# EAGLE schematic pcDuino3c_MB (EAGLE 7.2.0)

## Sheet 1 of 8: PWR
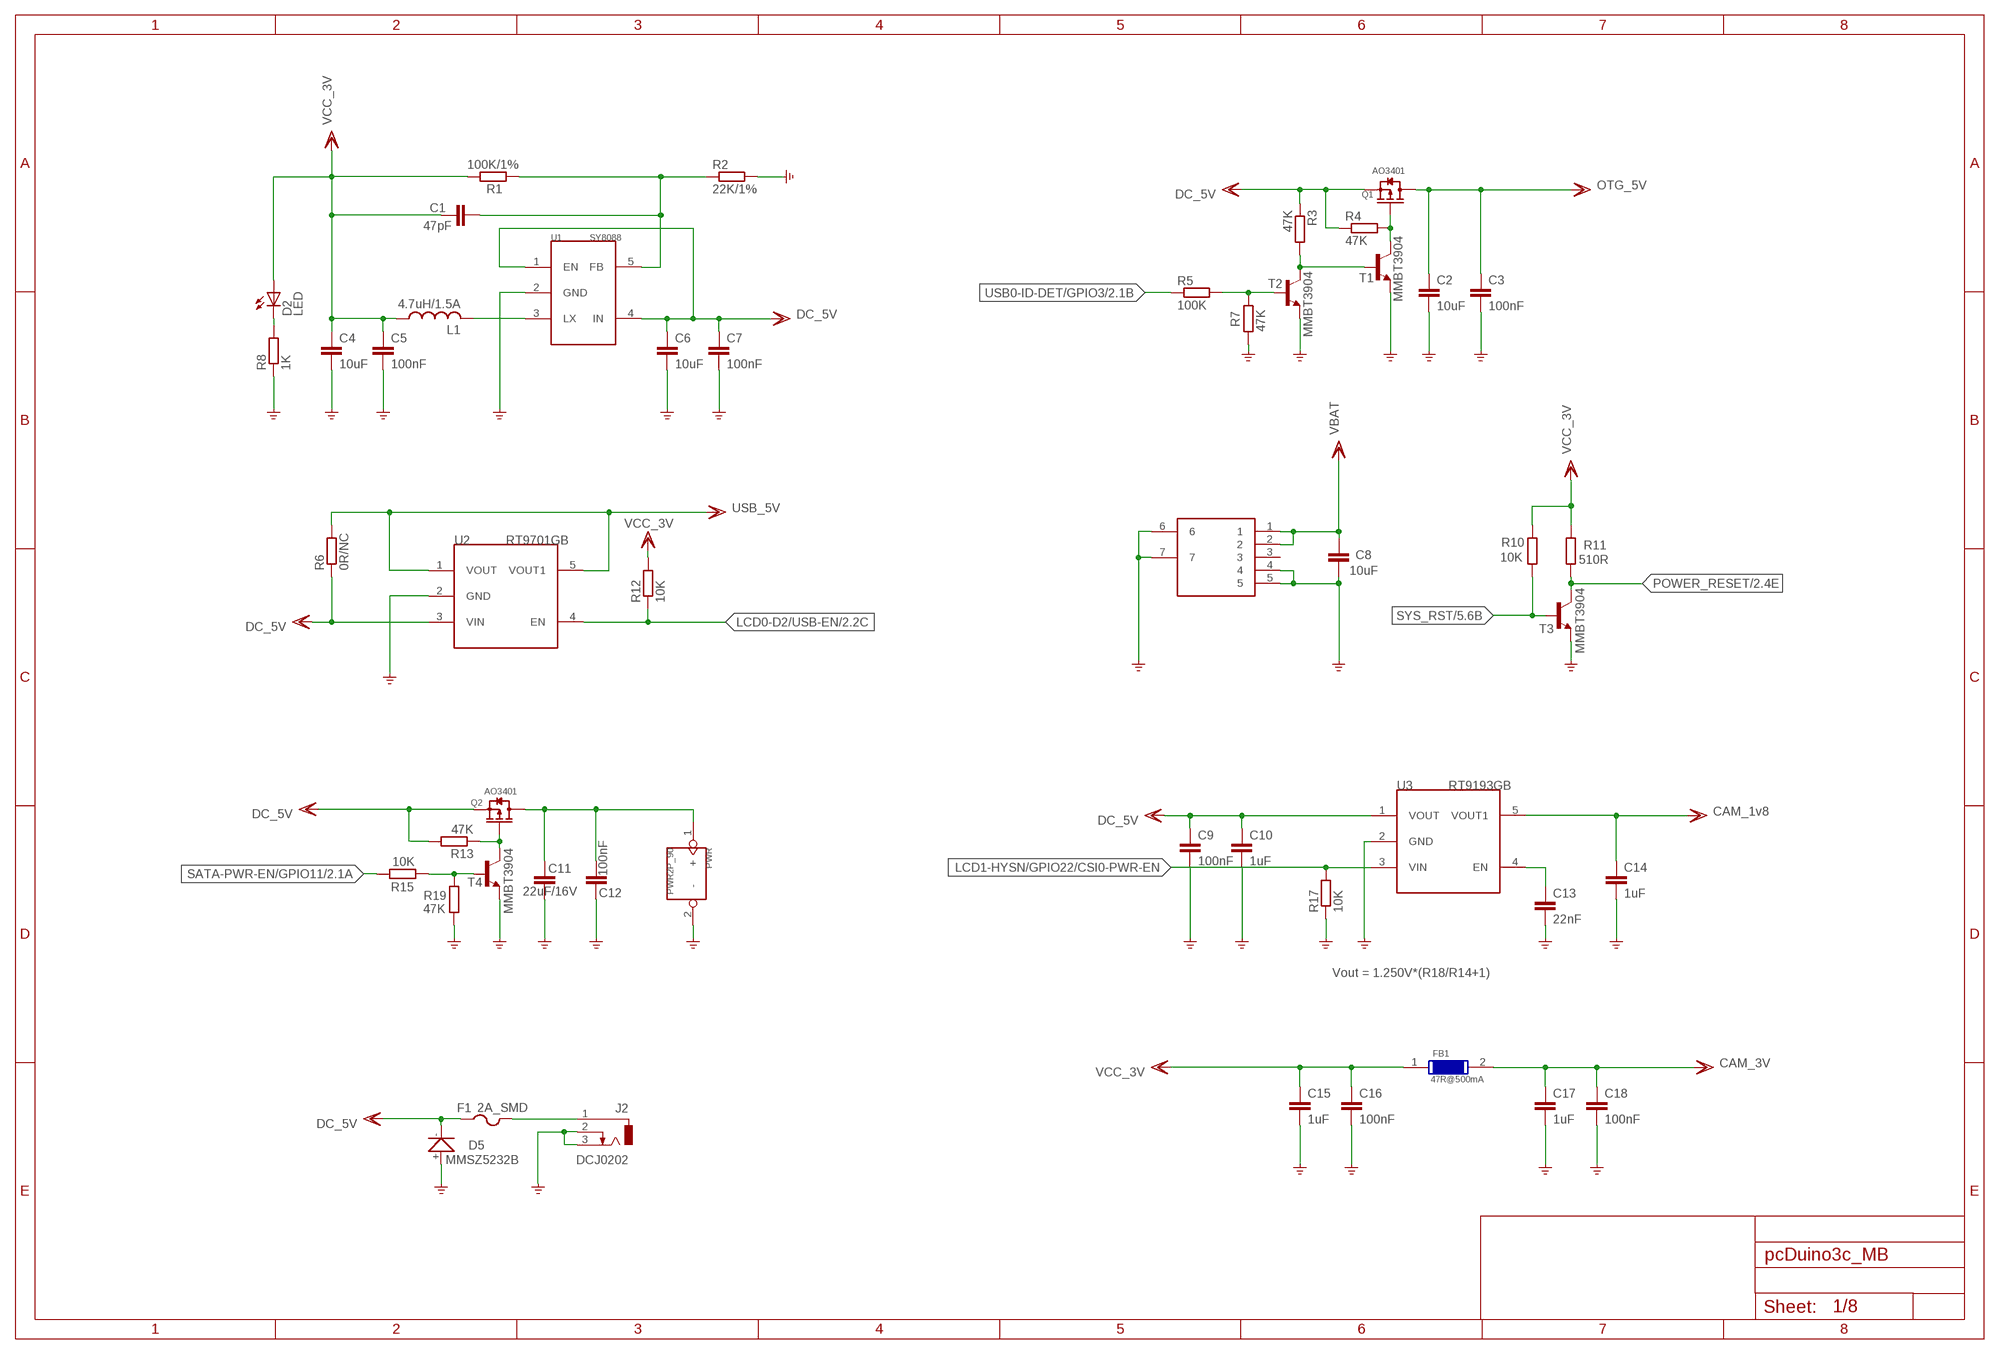
[diagram p0: schematic, sheet 1]

### Parts
C1  47pF  C-EUC0402K  [C0402K]
C2  10uF  C-EUC0805  [C0805]
C3  100nF  C-EUC0402K  [C0402K]
C4  10uF  C-EUC0805  [C0805]
C5  100nF  C-EUC0402K  [C0402K]
C6  10uF  C-EUC0805  [C0805]
C7  100nF  C-EUC0402K  [C0402K]
C8  10uF  C-EUC0805  [C0805]
C9  100nF  C-EUC0805  [C0805]
C10  1uF  C-EUC0402K  [C0402K]
C11  22uF/16V  C-EUC0805  [C0805]
C12  100nF  C-EUC0402K  [C0402K]
C13  22nF  C-EUC0402K  [C0402K]
C14  1uF  C-EUC0402K  [C0402K]
C15  1uF  C-EUC0805  [C0805]
C16  100nF  C-EUC0402K  [C0402K]
C17  1uF  C-EUC0805  [C0805]
C18  100nF  C-EUC0402K  [C0402K]
D2  LED  [CHIP-LED-0805]
D5  MMSZ5232B  DIODE-SMDSOD123  [SOD123]
F1  2A_SMD  PTCFUSE-1206  [R1206]
FB1  47R@500mA  LI0603EXXXR-10  [R0603]
J1  CON-BAT  [CON-BAT-5P-1MM]
J2  DCJ0202  [DCJ0202]
L1  4.7uH/1.5A  INDICATORCD32  [L_CD32]
PWR  PWR2P_90  [PWR2P_2.54]
Q1  AO3401  P-MOSSOT23  [SOT23]
Q2  AO3401  P-MOSSOT23  [SOT23]
R1  100K/1%  R-EU_R0402  [R0402]
R2  22K/1%  R-EU_R0402  [R0402]
R3  47K  R-EU_R0402  [R0402]
R4  47K  R-EU_R0402  [R0402]
R5  100K  R-EU_R0402  [R0402]
R6  0R/NC  R-EU_R0402  [R0402]
R7  47K  R-EU_R0402  [R0402]
R8  1K  R-EU_R0402  [R0402]
R10  10K  R-EU_R0402  [R0402]
R11  510R  R-EU_R0402  [R0402]
R12  10K  R-EU_R0402  [R0402]
R13  47K  R-EU_R0402  [R0402]
R15  10K  R-EU_R0402  [R0402]
R17  10K  R-EU_R0402  [R0402]
R19  47K  R-EU_R0402  [R0402]
T1  MMBT3904  BC808-NPN-SOT23-BEC  [SOT23-BEC]
T2  MMBT3904  BC808-NPN-SOT23-BEC  [SOT23-BEC]
T3  MMBT3904  BC808-NPN-SOT23-BEC  [SOT23-BEC]
T4  MMBT3904  BC808-NPN-SOT23-BEC  [SOT23-BEC]
U1  SY8088  [SOT23-5]
U2  RT9701GB  [SOT23-5]
U3  RT9193GB  RT9701GB  [SOT23-5]

### Nets
CAM_1V8: C14.1 U3.5(VOUT1) ; supply symbol labelled CAM_1v8 ; also sheet 5
CAM_3V: C17.1 C18.1 FB1.2 ; also sheet 5
DC_5V: C6.1 C7.1 C9.1 C10.1 D5.- F1.1 Q1.2(S) Q2.2(S) R3.1 R4.1 R6.1 R13.2 U1.1(EN) U1.4(IN) U2.3(VIN) U3.1(VOUT) ; also sheet 2,5,6,7
GND: C2.2 C3.2 C4.2 C5.2 C6.2 C7.2 C8.2 C9.2 C10.2 C11.2 C12.2 C13.2 C14.2 C15.2 C16.2 C17.2 C18.2 D5.+ J1.4 J1.5 J1.6 J1.7 J2.2 J2.3 PWR.2(-) R2.2 R7.1 R8.1 R17.1 R19.1 T1.E T2.E T3.E T4.E U1.2(GND) U2.2(GND) U3.2(GND) ; also sheet 2,3,4,5,6,7,8
LCD0-D2/USB-EN: R12.1 U2.4(EN) ; also sheet 2
LCD1-HYSN/GPIO22/CSI0-PWR-EN: R17.2 U3.3(VIN)
N$2: C13.1 U3.4(EN)
N$24: L1.2 U1.3(LX)
N$25: C1.2 R1.1 R2.1 U1.5(FB)
N$26: D2.C R8.2
N$27: Q1.1(G) R4.2 T1.C
N$28: R3.2 T1.B T2.C
N$29: R5.2 R7.2 T2.B
N$31: C11.1 C12.1 PWR.1(+) Q2.3(D)
N$32: F1.2 J2.1
N$75: Q2.1(G) R13.1 T4.C
N$76: R15.1 R19.2 T4.B
OTG_5V: C2.1 C3.1 Q1.3(D) ; also sheet 4
POWER_RESET: R11.1 T3.C ; also sheet 2
SATA-PWR-EN/GPIO11: R15.2 ; also sheet 2
SYS_RST: R10.1 T3.B ; also sheet 5,7
USB0-ID-DET/GPIO3: R5.1 ; also sheet 2,4
USB_5V: R6.2 U2.1(VOUT) U2.5(VOUT1) ; also sheet 4
VBAT: C8.1 J1.1 J1.2 ; also sheet 2
VCC_3V: C1.1 C4.1 C5.1 C15.1 C16.1 D2.A FB1.1 L1.1 R1.2 R10.2 R11.2 R12.2 ; also sheet 3,4,5,6,7,8
Unconnected: J1.3

### Notes on the sheet
- Vout = 1.250V*(R18/R14+1)

## Sheet 2 of 8: A20 Core
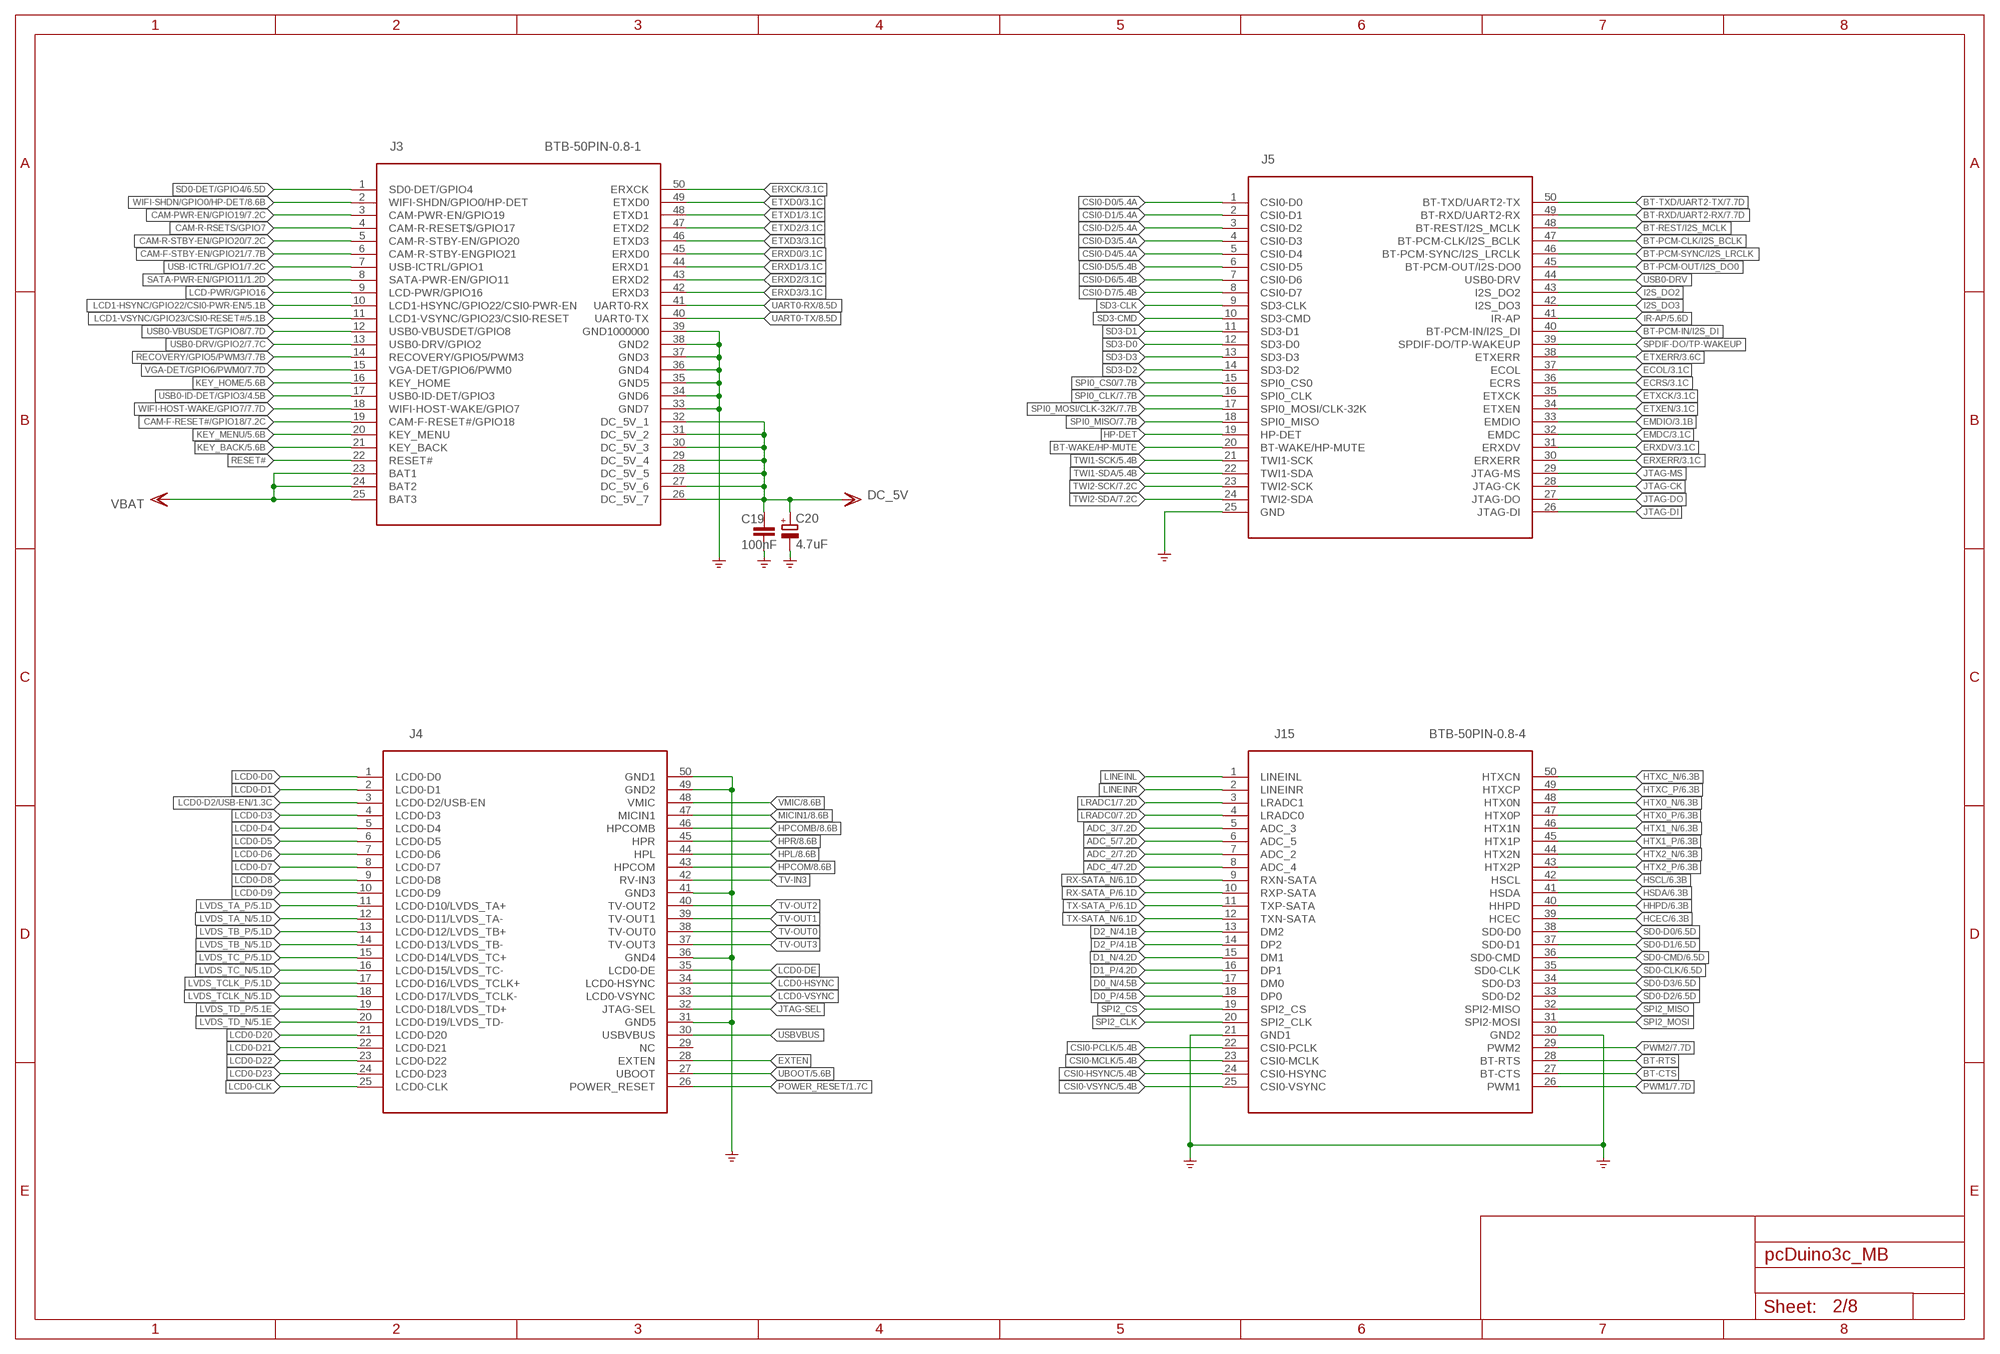
[diagram p1: schematic, sheet 2]

### Parts
C19  100nF  C-EUC0402K  [C0402K]
C20  4.7uF  CPOL-EUCT7343  [CT7343]
J3  BTB-50PIN-0.8-1  [BTB-50PIN-0.8]
J4  BTB-50PIN-0.8-3  [BTB-50PIN-0.8]
J5  BTB-50PIN-0.8-2  [BTB-50PIN-0.8]
J15  BTB-50PIN-0.8-4  [BTB-50PIN-0.8]

### Nets
ADC_2: J15.7(ADC_2) ; also sheet 7
ADC_3: J15.5(ADC_3) ; also sheet 7
ADC_4: J15.8(ADC_4) ; also sheet 7
ADC_5: J15.6(ADC_5) ; also sheet 7
BT-CTS: J15.27(BT-CTS)
BT-PCM-CLK/I2S_BCLK: J5.47(BT-PCM-CLK/I2S_BCLK)
BT-PCM-IN/I2S_DI: J5.40(BT-PCM-IN/I2S_DI)
BT-PCM-OUT/I2S_DO0: J5.45(BT-PCM-OUT/I2S-DO0)
BT-PCM-SYNC/I2S_LRCLK: J5.46(BT-PCM-SYNC/I2S_LRCLK)
BT-REST/I2S_MCLK: J5.48(BT-REST/I2S_MCLK)
BT-RTS: J15.28(BT-RTS)
BT-RXD/UART2-RX: J5.49(BT-RXD/UART2-RX) ; also sheet 7
BT-TXD/UART2-TX: J5.50(BT-TXD/UART2-TX) ; also sheet 7
BT-WAKE/HP-MUTE: J5.20(BT-WAKE/HP-MUTE)
CAM-F-RESET#/GPIO18: J3.19(CAM-F-RESET#/GPIO18) ; also sheet 7
CAM-F-STBY-EN/GPIO21: J3.6(CAM-R-STBY-ENGPIO21) ; also sheet 7
CAM-PWR-EN/GPIO19: J3.3(CAM-PWR-EN/GPIO19) ; also sheet 7
CAM-R-RSETS/GPIO7: J3.4(CAM-R-RESET$/GPIO17)
CAM-R-STBY-EN/GPIO20: J3.5(CAM-R-STBY-EN/GPIO20) ; also sheet 7
CSI0-D0: J5.1(CSI0-D0) ; also sheet 5
CSI0-D1: J5.2(CSI0-D1) ; also sheet 5
CSI0-D2: J5.3(CSI0-D2) ; also sheet 5
CSI0-D3: J5.4(CSI0-D3) ; also sheet 5
CSI0-D4: J5.5(CSI0-D4) ; also sheet 5
CSI0-D5: J5.6(CSI0-D5) ; also sheet 5
CSI0-D6: J5.7(CSI0-D6) ; also sheet 5
CSI0-D7: J5.8(CSI0-D7) ; also sheet 5
CSI0-HSYNC: J15.24(CSI0-HSYNC) ; also sheet 5
CSI0-MCLK: J15.23(CSI0-MCLK) ; also sheet 5
CSI0-PCLK: J15.22(CSI0-PCLK) ; also sheet 5
CSI0-VSYNC: J15.25(CSI0-VSYNC) ; also sheet 5
D0_N: J15.17(DM0) ; also sheet 4
D0_P: J15.18(DP0) ; also sheet 4
D1_N: J15.15(DM1) ; also sheet 4
D1_P: J15.16(DP1) ; also sheet 4
D2_N: J15.13(DM2) ; also sheet 4
D2_P: J15.14(DP2) ; also sheet 4
DC_5V: C19.1 C20.+ J3.26(DC_5V_7) J3.27(DC_5V_6) J3.28(DC_5V_5) J3.29(DC_5V_4) J3.30(DC_5V_3) J3.31(DC_5V_2) J3.32(DC_5V_1) ; also sheet 1,5,6,7
ECOL: J5.37(ECOL) ; also sheet 3
ECRS: J5.36(ECRS) ; also sheet 3
EMDC: J5.32(EMDC) ; also sheet 3
EMDIO: J5.33(EMDIO) ; also sheet 3
ERXCK: J3.50(ERXCK) ; also sheet 3
ERXD0: J3.45(ERXD0) ; also sheet 3
ERXD1: J3.44(ERXD1) ; also sheet 3
ERXD2: J3.43(ERXD2) ; also sheet 3
ERXD3: J3.42(ERXD3) ; also sheet 3
ERXDV: J5.31(ERXDV) ; also sheet 3
ERXERR: J5.30(ERXERR) ; also sheet 3
ETXCK: J5.35(ETXCK) ; also sheet 3
ETXD0: J3.49(ETXD0) ; also sheet 3
ETXD1: J3.48(ETXD1) ; also sheet 3
ETXD2: J3.47(ETXD2) ; also sheet 3
ETXD3: J3.46(ETXD3) ; also sheet 3
ETXEN: J5.34(ETXEN) ; also sheet 3
ETXERR: J5.38(ETXERR) ; also sheet 3
EXTEN: J4.28(EXTEN)
GND: C19.2 C20.- J3.33(GND7) J3.34(GND6) J3.35(GND5) J3.36(GND4) J3.37(GND3) J3.38(GND2) J3.39(GND1000000) J4.31(GND5) J4.36(GND4) J4.41(GND3) J4.49(GND2) J4.50(GND1) J5.25(GND) J15.21(GND1) J15.30(GND2) ; also sheet 1,3,4,5,6,7,8
HCEC: J15.39(HCEC) ; also sheet 6
HHPD: J15.40(HHPD) ; also sheet 6
HP-DET: J5.19(HP-DET)
HPCOM: J4.43(HPCOM) ; also sheet 8
HPCOMB: J4.46(HPCOMB) ; also sheet 8
HPL: J4.44(HPL) ; also sheet 8
HPR: J4.45(HPR) ; also sheet 8
HSCL: J15.42(HSCL) ; also sheet 6
HSDA: J15.41(HSDA) ; also sheet 6
HTX0_N: J15.48(HTX0N) ; also sheet 6
HTX0_P: J15.47(HTX0P) ; also sheet 6
HTX1_N: J15.46(HTX1N) ; also sheet 6
HTX1_P: J15.45(HTX1P) ; also sheet 6
HTX2_N: J15.44(HTX2N) ; also sheet 6
HTX2_P: J15.43(HTX2P) ; also sheet 6
HTXC_N: J15.50(HTXCN) ; also sheet 6
HTXC_P: J15.49(HTXCP) ; also sheet 6
I2S_DO2: J5.43(I2S_DO2)
I2S_DO3: J5.42(I2S_DO3)
IR-AP: J5.41(IR-AP) ; also sheet 5
JTAG-CK: J5.28(JTAG-CK)
JTAG-DI: J5.26(JTAG-DI)
JTAG-DO: J5.27(JTAG-DO)
JTAG-MS: J5.29(JTAG-MS)
JTAG-SEL: J4.32(JTAG-SEL)
KEY_BACK: J3.21(KEY_BACK) ; also sheet 5
KEY_HOME: J3.16(KEY_HOME) ; also sheet 5
KEY_MENU: J3.20(KEY_MENU) ; also sheet 5
LCD0-CLK: J4.25(LCD0-CLK)
LCD0-D0: J4.1(LCD0-D0)
LCD0-D1: J4.2(LCD0-D1)
LCD0-D2/USB-EN: J4.3(LCD0-D2/USB-EN) ; also sheet 1
LCD0-D3: J4.4(LCD0-D3)
LCD0-D4: J4.5(LCD0-D4)
LCD0-D5: J4.6(LCD0-D5)
LCD0-D6: J4.7(LCD0-D6)
LCD0-D7: J4.8(LCD0-D7)
LCD0-D8: J4.9(LCD0-D8)
LCD0-D9: J4.10(LCD0-D9)
LCD0-D20: J4.21(LCD0-D20)
LCD0-D21: J4.22(LCD0-D21)
LCD0-D22: J4.23(LCD0-D22)
LCD0-D23: J4.24(LCD0-D23)
LCD0-DE: J4.35(LCD0-DE)
LCD0-HSYNC: J4.34(LCD0-HSYNC)
LCD0-VSYNC: J4.33(LCD0-VSYNC)
LCD1-HSYNC/GPIO22/CSI0-PWR-EN: J3.10(LCD1-HSYNC/GPIO22/CSI0-PWR-EN) ; also sheet 5
LCD1-VSYNC/GPIO23/CSI0-RESET#: J3.11(LCD1-VSYNC/GPIO23/CSI0-RESET) ; also sheet 5
LCD-PWR/GPIO16: J3.9(LCD-PWR/GPIO16)
LINEINL: J15.1(LINEINL)
LINEINR: J15.2(LINEINR)
LRADC0: J15.4(LRADC0) ; also sheet 7
LRADC1: J15.3(LRADC1) ; also sheet 7
LVDS_TA_N: J4.12(LCD0-D11/LVDS_TA-) ; also sheet 5
LVDS_TA_P: J4.11(LCD0-D10/LVDS_TA+) ; also sheet 5
LVDS_TB_N: J4.14(LCD0-D13/LVDS_TB-) ; also sheet 5
LVDS_TB_P: J4.13(LCD0-D12/LVDS_TB+) ; also sheet 5
LVDS_TC_N: J4.16(LCD0-D15/LVDS_TC-) ; also sheet 5
LVDS_TC_P: J4.15(LCD0-D14/LVDS_TC+) ; also sheet 5
LVDS_TCLK_N: J4.18(LCD0-D17/LVDS_TCLK-) ; also sheet 5
LVDS_TCLK_P: J4.17(LCD0-D16/LVDS_TCLK+) ; also sheet 5
LVDS_TD_N: J4.20(LCD0-D19/LVDS_TD-) ; also sheet 5
LVDS_TD_P: J4.19(LCD0-D18/LVDS_TD+) ; also sheet 5
MICIN1: J4.47(MICIN1) ; also sheet 8
POWER_RESET: J4.26(POWER_RESET) ; also sheet 1
PWM1: J15.26(PWM1) ; also sheet 7
PWM2: J15.29(PWM2) ; also sheet 7
RECOVERY/GPIO5/PWM3: J3.14(RECOVERY/GPIO5/PWM3) ; also sheet 7
RESET#: J3.22(RESET#)
RX-SATA_N: J15.9(RXN-SATA) ; also sheet 6
RX-SATA_P: J15.10(RXP-SATA) ; also sheet 6
SATA-PWR-EN/GPIO11: J3.8(SATA-PWR-EN/GPIO11) ; also sheet 1
SD0-CLK: J15.35(SD0-CLK) ; also sheet 6
SD0-CMD: J15.36(SD0-CMD) ; also sheet 6
SD0-D0: J15.38(SD0-D0) ; also sheet 6
SD0-D1: J15.37(SD0-D1) ; also sheet 6
SD0-D2: J15.33(SD0-D2) ; also sheet 6
SD0-D3: J15.34(SD0-D3) ; also sheet 6
SD0-DET/GPIO4: J3.1(SD0-DET/GPIO4) ; also sheet 6
SD3-CLK: J5.9(SD3-CLK)
SD3-CMD: J5.10(SD3-CMD)
SD3-D0: J5.12(SD3-D0)
SD3-D1: J5.11(SD3-D1)
SD3-D2: J5.14(SD3-D2)
SD3-D3: J5.13(SD3-D3)
SPDIF-DO/TP-WAKEUP: J5.39(SPDIF-DO/TP-WAKEUP)
SPI0_CLK: J5.16(SPI0_CLK) ; also sheet 7
SPI0_CS0: J5.15(SPI0_CS0) ; also sheet 7
SPI0_MISO: J5.18(SPI0_MISO) ; also sheet 7
SPI0_MOSI/CLK-32K: J5.17(SPI0_MOSI/CLK-32K) ; also sheet 7
SPI2_CLK: J15.20(SPI2_CLK)
SPI2_CS: J15.19(SPI2_CS)
SPI2_MISO: J15.32(SPI2-MISO)
SPI2_MOSI: J15.31(SPI2-MOSI)
TV-IN3: J4.42(RV-IN3)
TV-OUT0: J4.38(TV-OUT0)
TV-OUT1: J4.39(TV-OUT1)
TV-OUT2: J4.40(TV-OUT2)
TV-OUT3: J4.37(TV-OUT3)
TWI1-SCK: J5.21(TWI1-SCK) ; also sheet 5
TWI1-SDA: J5.22(TWI1-SDA) ; also sheet 5
TWI2-SCK: J5.23(TWI2-SCK) ; also sheet 7
TWI2-SDA: J5.24(TWI2-SDA) ; also sheet 7
TX-SATA_N: J15.12(TXN-SATA) ; also sheet 6
TX-SATA_P: J15.11(TXP-SATA) ; also sheet 6
UART0-RX: J3.41(UART0-RX) ; also sheet 8
UART0-TX: J3.40(UART0-TX) ; also sheet 8
UBOOT: J4.27(UBOOT) ; also sheet 5
USB0-DRV: J5.44(USB0-DRV)
USB0-DRV/GPIO2: J3.13(USB0-DRV/GPIO2) ; also sheet 7
USB0-ID-DET/GPIO3: J3.17(USB0-ID-DET/GPIO3) ; also sheet 1,4
USB0-VBUSDET/GPIO8: J3.12(USB0-VBUSDET/GPIO8) ; also sheet 7
USB-ICTRL/GPIO1: J3.7(USB-ICTRL/GPIO1) ; also sheet 7
USBVBUS: J4.30(USBVBUS)
VBAT: J3.23(BAT1) J3.24(BAT2) J3.25(BAT3) ; also sheet 1
VGA-DET/GPIO6/PWM0: J3.15(VGA-DET/GPIO6/PWM0) ; also sheet 7
VMIC: J4.48(VMIC) ; also sheet 8
WIFI-HOST-WAKE/GPIO7: J3.18(WIFI-HOST-WAKE/GPIO7) ; also sheet 7
WIFI-SHDN/GPIO0/HP-DET: J3.2(WIFI-SHDN/GPIO0/HP-DET) ; also sheet 8
Unconnected: J4.29(NC)

## Sheet 3 of 8: EMAC
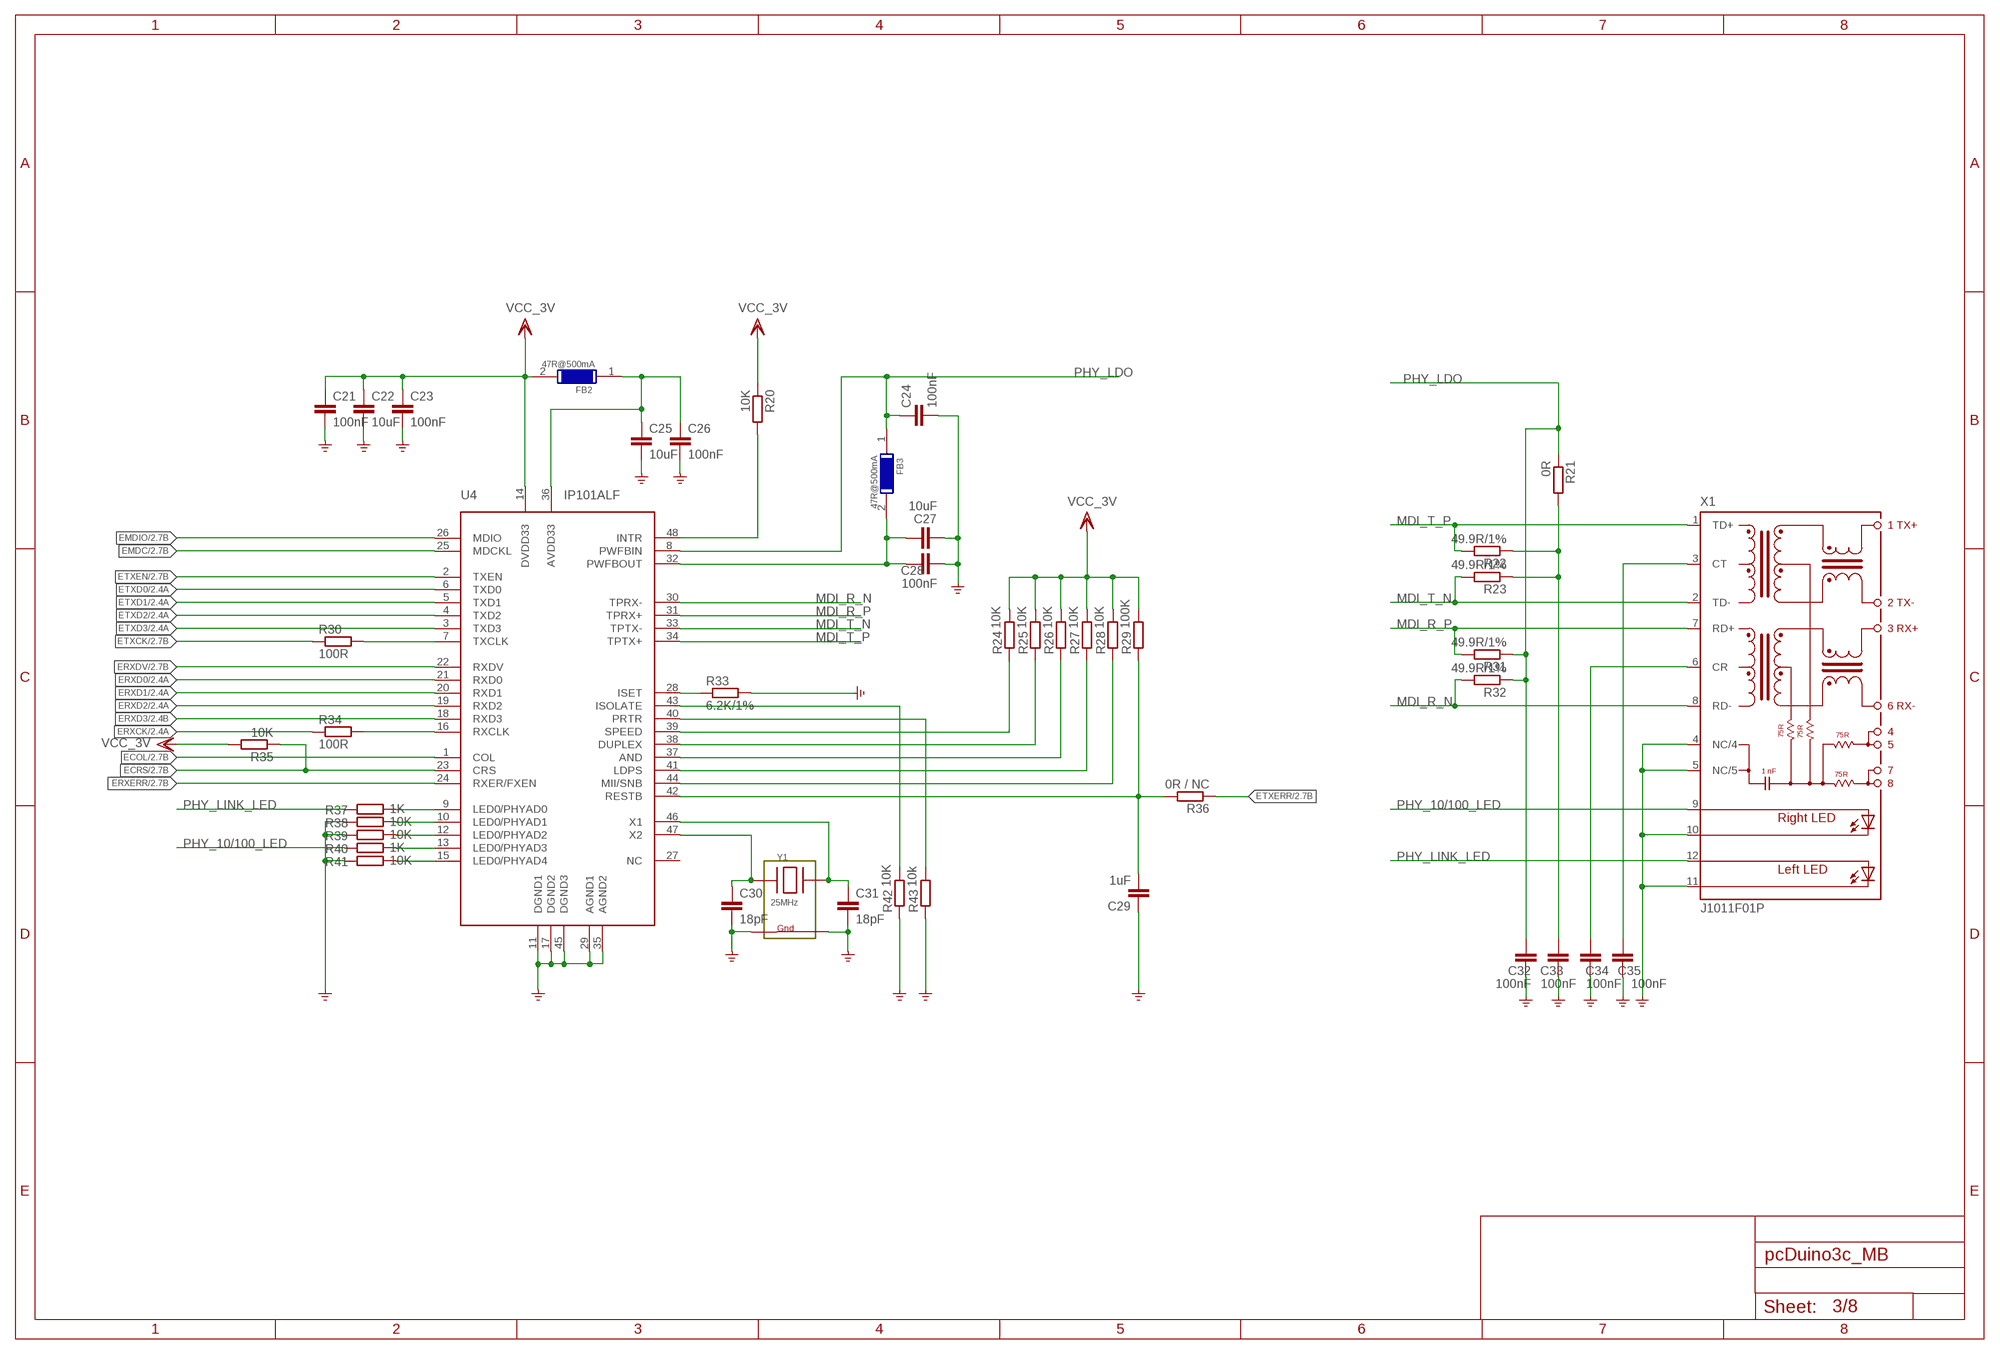
[diagram p2: schematic, sheet 3]

### Parts
C21  100nF  C-EUC0402K  [C0402K]
C22  10uF  C-EUC0805  [C0805]
C23  100nF  C-EUC0402K  [C0402K]
C24  100nF  C-EUC0402K  [C0402K]
C25  10uF  C-EUC0805  [C0805]
C26  100nF  C-EUC0402K  [C0402K]
C27  10uF  C-EUC0805  [C0805]
C28  100nF  C-EUC0402K  [C0402K]
C29  1uF  C-EUC0402K  [C0402K]
C30  18pF  C-EUC0402K  [C0402K]
C31  18pF  C-EUC0402K  [C0402K]
C32  100nF  C-EUC0402K  [C0402K]
C33  100nF  C-EUC0402K  [C0402K]
C34  100nF  C-EUC0402K  [C0402K]
C35  100nF  C-EUC0402K  [C0402K]
FB2  47R@500mA  LI0603EXXXR-10  [R0603]
FB3  47R@500mA  LI0603EXXXR-10  [R0603]
R20  10K  R-EU_R0402  [R0402]
R21  0R  R-EU_R0402  [R0402]
R22  49.9R/1%  R-EU_R0402  [R0402]
R23  49.9R/1%  R-EU_R0402  [R0402]
R24  10K  R-EU_R0402  [R0402]
R25  10K  R-EU_R0402  [R0402]
R26  10K  R-EU_R0402  [R0402]
R27  10K  R-EU_R0402  [R0402]
R28  10K  R-EU_R0402  [R0402]
R29  100K  R-EU_R0402  [R0402]
R30  100R  R-EU_R0402  [R0402]
R31  49.9R/1%  R-EU_R0402  [R0402]
R32  49.9R/1%  R-EU_R0402  [R0402]
R33  6.2K/1%  R-EU_R0402  [R0402]
R34  100R  R-EU_R0402  [R0402]
R35  10K  R-EU_R0402  [R0402]
R36  0R / NC  R-EU_R0402  [R0402]
R37  1K  R-EU_R0402  [R0402]
R38  10K  R-EU_R0402  [R0402]
R39  10K  R-EU_R0402  [R0402]
R40  1K  R-EU_R0402  [R0402]
R41  10K  R-EU_R0402  [R0402]
R42  10K  R-EU_R0402  [R0402]
R43  10k  R-EU_R0402  [R0402]
U4  IP101ALF  [LQFP48-7X7]
X1  J1011F01P  [J1]
Y1  25MHz  XTAL-4-3225  [NX3225]

### Nets
ECOL: U4.1(COL) ; also sheet 2
ECRS: R35.1 U4.23(CRS) ; also sheet 2
EMDC: U4.25(MDCKL) ; also sheet 2
EMDIO: U4.26(MDIO) ; also sheet 2
ERXCK: R34.1 ; also sheet 2
ERXD0: U4.21(RXD0) ; also sheet 2
ERXD1: U4.20(RXD1) ; also sheet 2
ERXD2: U4.19(RXD2) ; also sheet 2
ERXD3: U4.18(RXD3) ; also sheet 2
ERXDV: U4.22(RXDV) ; also sheet 2
ERXERR: U4.24(RXER/FXEN) ; also sheet 2
ETXCK: R30.1 ; also sheet 2
ETXD0: U4.6(TXD0) ; also sheet 2
ETXD1: U4.5(TXD1) ; also sheet 2
ETXD2: U4.4(TXD2) ; also sheet 2
ETXD3: U4.3(TXD3) ; also sheet 2
ETXEN: U4.2(TXEN) ; also sheet 2
ETXERR: R36.1 ; also sheet 2
GND: C21.2 C22.2 C23.2 C24.2 C25.2 C26.2 C27.1 C28.2 C29.1 C30.2 C31.2 C32.1 C33.1 C34.1 C35.1 R33.2 R38.1 R39.1 R41.1 R42.1 R43.1 U4.11(DGND1) U4.17(DGND2) U4.29(AGND1) U4.35(AGND2) U4.45(DGND3) X1.4(NC/4) X1.5(NC/5) X1.10(C-R) X1.11(C-L) Y1.2(G1) Y1.4(G2) ; also sheet 1,2,4,5,6,7,8
MDI_R_N: R32.2 U4.30(TPRX-) X1.8(RD-)
MDI_R_P: R31.2 U4.31(TPRX+) X1.7(RD+)
MDI_T_N: R23.2 U4.33(TPTX-) X1.2(TD-)
MDI_T_P: R22.2 U4.34(TPTX+) X1.1(TD+)
N$33: C25.1 C26.1 FB2.1 U4.36(AVDD33)
N$34: C34.2 X1.6(CR)
N$35: C35.2 X1.3(CT)
N$37: C33.2 R21.2 R22.1 R23.1
N$39: R20.2 U4.48(INTR)
N$41: C27.2 C28.1 FB3.2 U4.32(PWFBOUT)
N$45: R33.1 U4.28(ISET)
N$47: R37.2 U4.9(LED0/PHYAD0)
N$48: R38.2 U4.10(LED0/PHYAD1)
N$49: R39.2 U4.12(LED0/PHYAD2)
N$50: R40.2 U4.13(LED0/PHYAD3)
N$51: R41.2 U4.15(LED0/PHYAD4)
N$52: C30.1 U4.47(X2) Y1.1(X1)
N$92: R34.2 U4.16(RXCLK)
N$93: R30.2 U4.7(TXCLK)
N$96: C31.1 U4.46(X1) Y1.3(X2)
N$98: R27.1 U4.41(LDPS)
N$99: R42.2 U4.43(ISOLATE)
N$100: R43.2 U4.40(PRTR)
N$103: R24.1 U4.39(SPEED)
N$104: R25.1 U4.38(DUPLEX)
N$105: R26.1 U4.37(AND)
N$106: R28.1 U4.44(MII/SNB)
N$107: C29.2 R29.1 R36.2 U4.42(RESTB)
PHY_10/100_LED: R40.1 X1.9(A-R)
PHY_LDO: C24.1 C32.2 FB3.1 R21.1 R31.1 R32.1 U4.8(PWFBIN)
PHY_LINK_LED: R37.1 X1.12(AL)
VCC_3V: C21.1 C22.1 C23.1 FB2.2 R20.1 R24.2 R25.2 R26.2 R27.2 R28.2 R29.2 R35.2 U4.14(DVDD33) ; also sheet 1,4,5,6,7,8
Unconnected: U4.27(NC)

## Sheet 4 of 8: USB
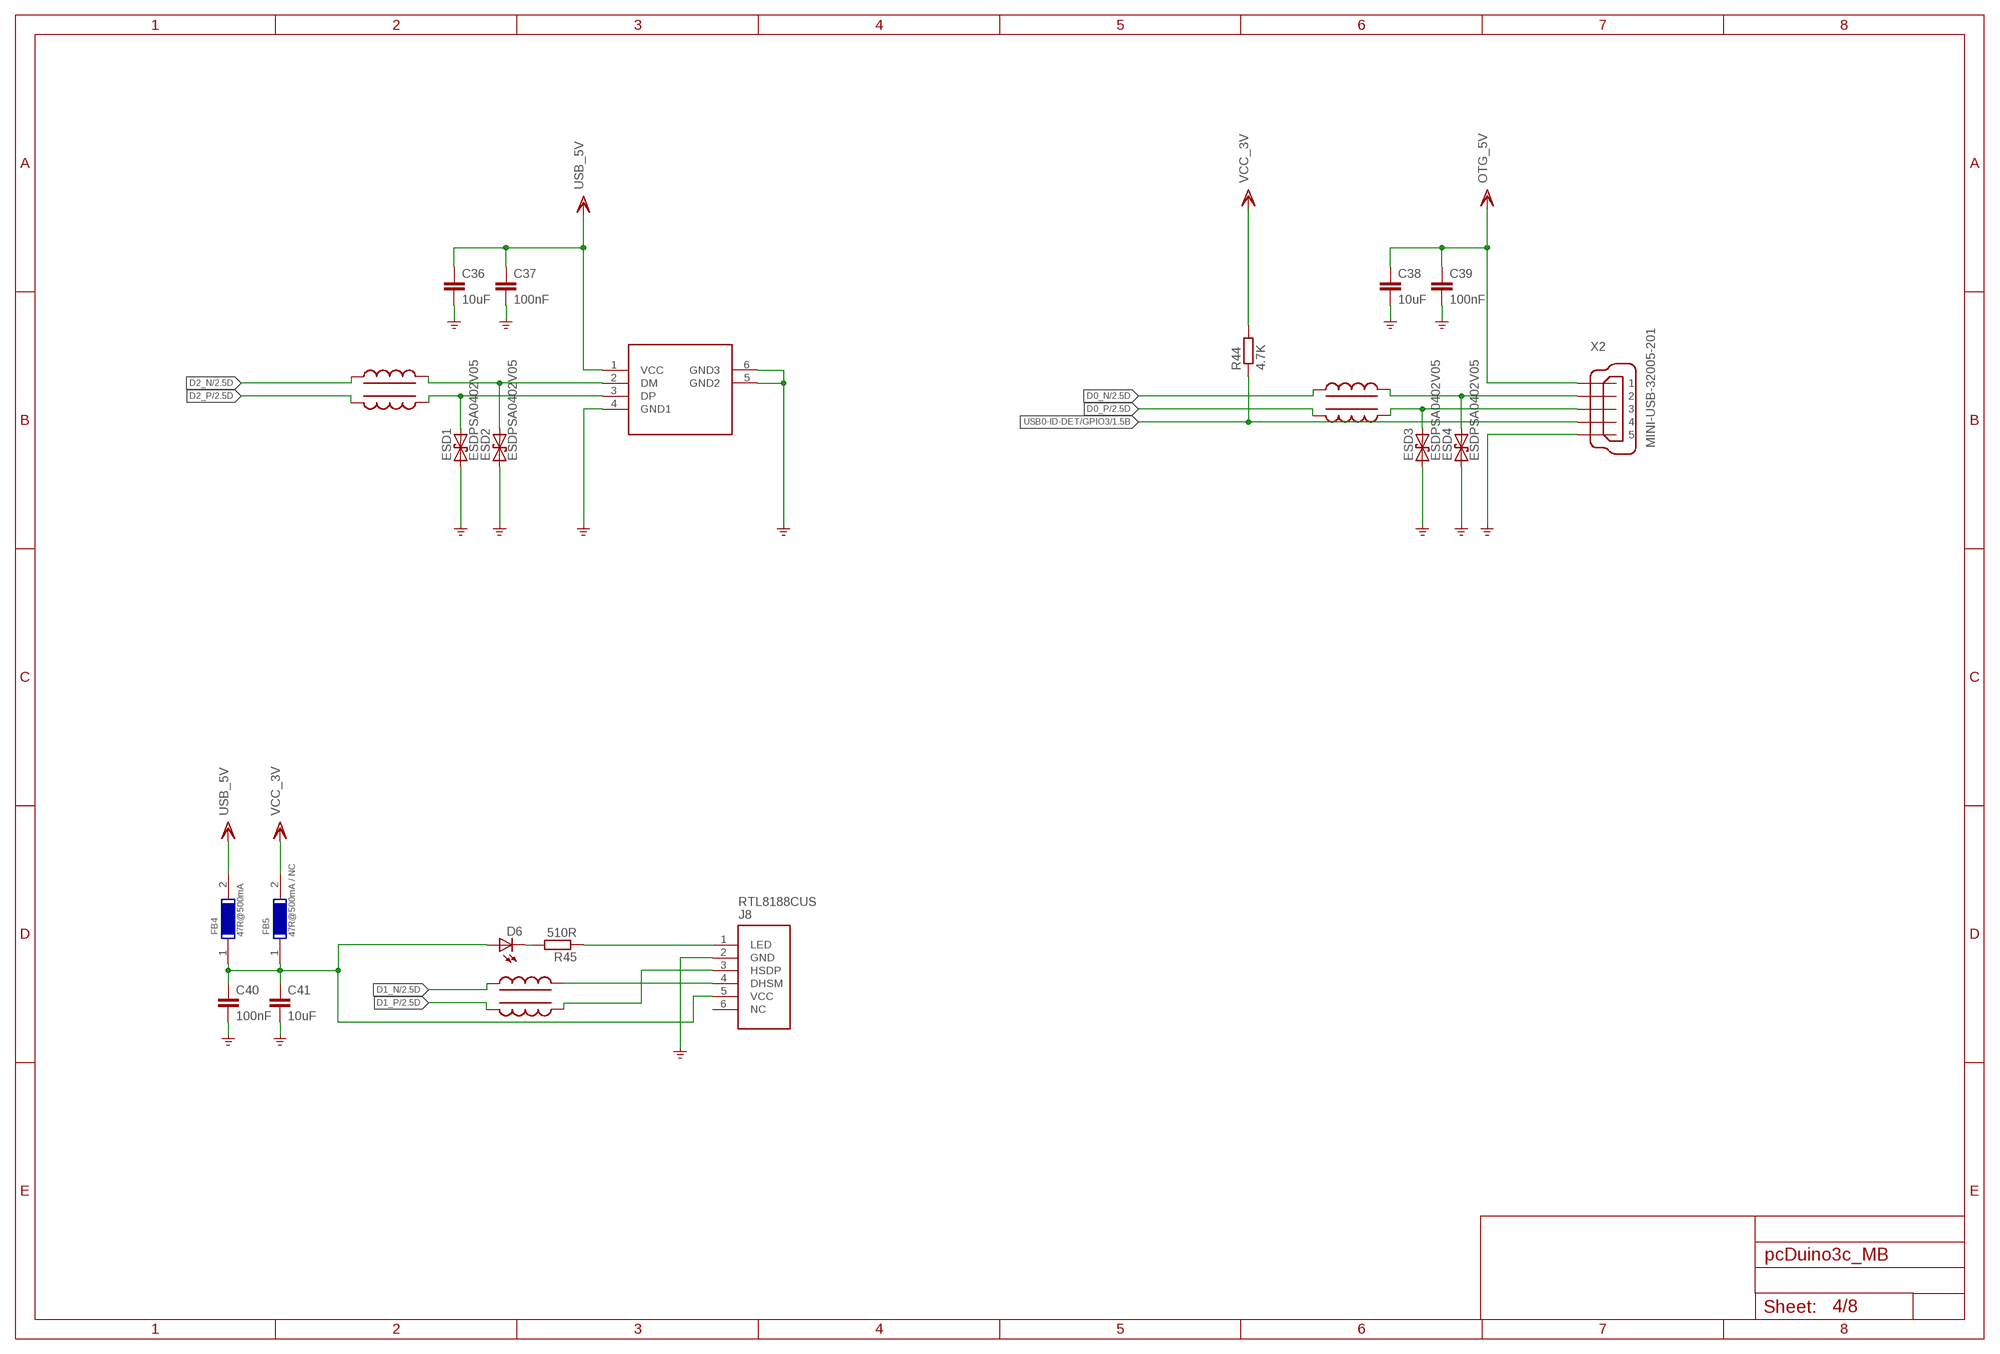
[diagram p3: schematic, sheet 4]

### Parts
C36  10uF  C-EUC0805  [C0805]
C37  100nF  C-EUC0402K  [C0402K]
C38  10uF  C-EUC0805  [C0805]
C39  100nF  C-EUC0402K  [C0402K]
C40  100nF  C-EUC0805  [C0805]
C41  10uF  C-EUC0402K  [C0402K]
D6  LED  [CHIP-LED-0805]
ESD1  ESDPSA0402V05  [R0402]
ESD2  ESDPSA0402V05  [R0402]
ESD3  ESDPSA0402V05  [R0402]
ESD4  ESDPSA0402V05  [R0402]
FB4  47R@500mA  LI0603EXXXR-10  [R0603]
FB5  47R@500mA / NC  LI0603EXXXR-10  [R0603]
J7  CON-USB  [CON-USB]
J8  RTL8188CUS  PCDUINO_WIFI_P1  [PCDUINO-WIFI-0_1PRIMARY]
L2  IND-CL-2M2012  [CL-2M2012]
L3  IND-CL-2M2012  [CL-2M2012]
L4  IND-CL-2M2012  [CL-2M2012]
R44  4.7K  R-EU_R0402  [R0402]
R45  510R  R-EU_R0402  [R0402]
X2  MINI-USB-32005-201  [32005-201]

### Nets
D0_N: L3.1 ; also sheet 2
D0_P: L3.2 ; also sheet 2
D1_N: L4.1 ; also sheet 2
D1_P: L4.2 ; also sheet 2
D2_N: L2.1 ; also sheet 2
D2_P: L2.2 ; also sheet 2
GND: C36.2 C37.2 C38.2 C39.2 C40.2 C41.2 ESD1.1 ESD2.1 ESD3.1 ESD4.1 J7.4(GND1) J7.5(GND2) J7.6(GND3) J8.2(GND) X2.5 ; also sheet 1,2,3,5,6,7,8
N$36: J8.4(DHSM) L4.4
N$38: J8.1(LED) R45.1
N$42_P: J8.3(HSDP) L4.3
N$46: D6.C R45.2
N$55: ESD2.2 J7.2(DM) L2.4
N$57: ESD1.2 J7.3(DP) L2.3
N$59: ESD4.2 L3.4 X2.2
N$68: C40.1 C41.1 D6.A FB4.1 FB5.1 J8.5(VCC)
N$79: ESD3.2 L3.3 X2.3
OTG_5V: C38.1 C39.1 X2.1 ; also sheet 1
USB0-ID-DET/GPIO3: R44.1 X2.4 ; also sheet 1,2
USB_5V: C36.1 C37.1 FB4.2 J7.1(VCC) ; also sheet 1
VCC_3V: FB5.2 R44.2 ; also sheet 1,3,5,6,7,8
Unconnected: J8.6(NC)

## Sheet 5 of 8: CAM & KEY & LVDS & IR
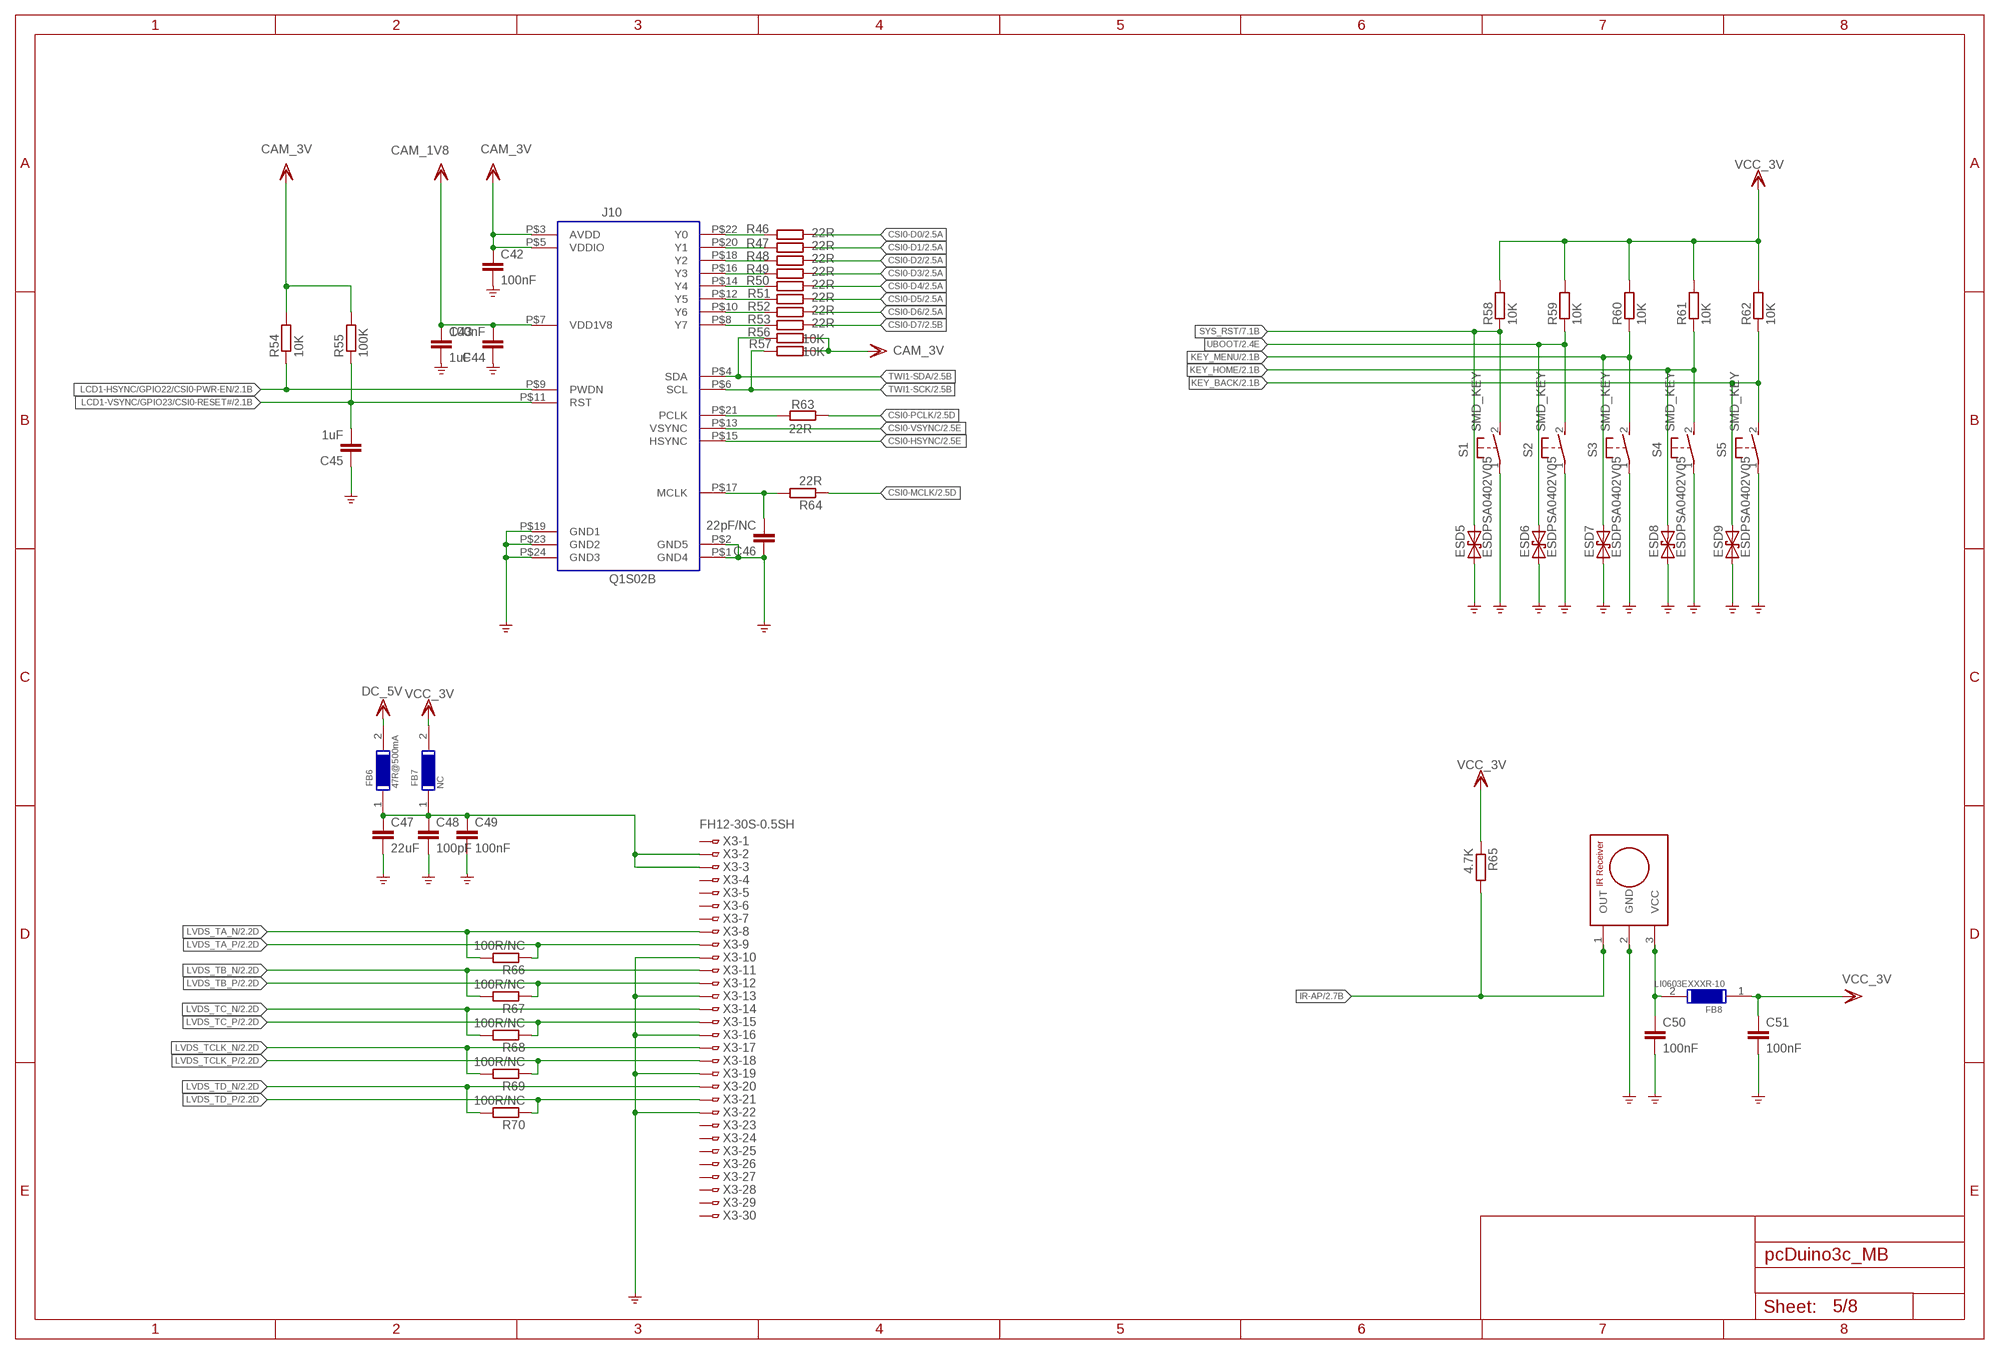
[diagram p4: schematic, sheet 5]

### Parts
C42  100nF  C-EUC0402K  [C0402K]
C43  1uF  C-EUC0805  [C0805]
C44  100nF  C-EUC0402K  [C0402K]
C45  1uF  C-EUC0402K  [C0402K]
C46  22pF/NC  C-EUC0402K  [C0402K]
C47  22uF  C-EUC0805  [C0805]
C48  100pF  C-EUC0402K  [C0402K]
C49  100nF  C-EUC0805  [C0805]
C50  100nF  C-EUC0805  [C0805]
C51  100nF  C-EUC0402K  [C0402K]
ESD5  ESDPSA0402V05  [R0402]
ESD6  ESDPSA0402V05  [R0402]
ESD7  ESDPSA0402V05  [R0402]
ESD8  ESDPSA0402V05  [R0402]
ESD9  ESDPSA0402V05  [R0402]
FB6  47R@500mA  LI0603EXXXR-10  [R0603]
FB7  NC  LI0603EXXXR-10  [R0603]
FB8  LI0603EXXXR-10  [R0603]
J10  Q1S02B  [AXK824145WG]
R46  22R  R-EU_R0402  [R0402]
R47  22R  R-EU_R0402  [R0402]
R48  22R  R-EU_R0402  [R0402]
R49  22R  R-EU_R0402  [R0402]
R50  22R  R-EU_R0402  [R0402]
R51  22R  R-EU_R0402  [R0402]
R52  22R  R-EU_R0402  [R0402]
R53  22R  R-EU_R0402  [R0402]
R54  10K  R-EU_R0402  [R0402]
R55  100K  R-EU_R0402  [R0402]
R56  10K  R-EU_R0402  [R0402]
R57  10K  R-EU_R0402  [R0402]
R58  10K  R-EU_R0402  [R0402]
R59  10K  R-EU_R0402  [R0402]
R60  10K  R-EU_R0402  [R0402]
R61  10K  R-EU_R0402  [R0402]
R62  10K  R-EU_R0402  [R0402]
R63  22R  R-EU_R0402  [R0402]
R64  22R  R-EU_R0402  [R0402]
R65  4.7K  R-EU_R0402  [R0402]
R66  100R/NC  R-EU_R0402  [R0402]
R67  100R/NC  R-EU_R0402  [R0402]
R68  100R/NC  R-EU_R0402  [R0402]
R69  100R/NC  R-EU_R0402  [R0402]
R70  100R/NC  R-EU_R0402  [R0402]
S1  SMD_KEY  [KEY]
S2  SMD_KEY  [KEY]
S3  SMD_KEY  [KEY]
S4  SMD_KEY  [KEY]
S5  SMD_KEY  [KEY]
U9  INFARED  [HS/VS1838]
X3  FH12-30S-0.5SH  [FH12-30S-0.5SH]

### Nets
CAM_1V8: C43.1 C44.2 J10.P$7(VDD1V8) ; also sheet 1
CAM_3V: C42.1 J10.P$3(AVDD) J10.P$5(VDDIO) R54.2 R55.2 R56.1 R57.1 ; also sheet 1
CSI0-D0: R46.1 ; also sheet 2
CSI0-D1: R47.1 ; also sheet 2
CSI0-D2: R48.1 ; also sheet 2
CSI0-D3: R49.1 ; also sheet 2
CSI0-D4: R50.1 ; also sheet 2
CSI0-D5: R51.1 ; also sheet 2
CSI0-D6: R52.1 ; also sheet 2
CSI0-D7: R53.1 ; also sheet 2
CSI0-HSYNC: J10.P$15(HSYNC) ; also sheet 2
CSI0-MCLK: R64.1 ; also sheet 2
CSI0-PCLK: R63.1 ; also sheet 2
CSI0-VSYNC: J10.P$13(VSYNC) ; also sheet 2
DC_5V: FB6.2 ; also sheet 1,2,6,7
GND: C42.2 C43.2 C44.1 C45.1 C46.1 C47.2 C48.2 C49.2 C50.2 C51.2 ESD5.1 ESD6.1 ESD7.1 ESD8.1 ESD9.1 J10.P$1(GND4) J10.P$2(GND5) J10.P$19(GND1) J10.P$23(GND2) J10.P$24(GND3) S1.1(P) S2.1(P) S3.1(P) S4.1(P) S5.1(P) U9.2(GND) X3.9 X3.12 X3.15 X3.18 X3.21 ; also sheet 1,2,3,4,6,7,8
IR-AP: R65.2 U9.1(OUT) ; also sheet 2
KEY_BACK: ESD9.2 R62.1 S5.2(S) ; also sheet 2
KEY_HOME: ESD8.2 R61.1 S4.2(S) ; also sheet 2
KEY_MENU: ESD7.2 R60.1 S3.2(S) ; also sheet 2
LCD1-HSYNC/GPIO22/CSI0-PWR-EN: J10.P$9(PWDN) R54.1 ; also sheet 2
LCD1-VSYNC/GPIO23/CSI0-RESET#: C45.2 J10.P$11(RST) R55.1 ; also sheet 2
LVDS_TA_N: R66.2 X3.23 ; also sheet 2
LVDS_TA_P: R66.1 X3.22 ; also sheet 2
LVDS_TB_N: R67.2 X3.20 ; also sheet 2
LVDS_TB_P: R67.1 X3.19 ; also sheet 2
LVDS_TC_N: R68.2 X3.17 ; also sheet 2
LVDS_TC_P: R68.1 X3.16 ; also sheet 2
LVDS_TCLK_N: R69.2 X3.14 ; also sheet 2
LVDS_TCLK_P: R69.1 X3.13 ; also sheet 2
LVDS_TD_N: R70.2 X3.11 ; also sheet 2
LVDS_TD_P: R70.1 X3.10 ; also sheet 2
N$11: J10.P$22(Y0) R46.2
N$13: J10.P$20(Y1) R47.2
N$15: J10.P$18(Y2) R48.2
N$17: J10.P$16(Y3) R49.2
N$18: J10.P$14(Y4) R50.2
N$19: J10.P$12(Y5) R51.2
N$20: J10.P$10(Y6) R52.2
N$21: J10.P$8(Y7) R53.2
N$22: J10.P$21(PCLK) R63.2
N$23: C46.2 J10.P$17(MCLK) R64.2
N$53: C47.1 C48.1 C49.1 FB6.1 FB7.1 X3.28 X3.29
N$54: C50.1 FB8.2 U9.3(VCC)
SYS_RST: ESD5.2 R58.1 S1.2(S) ; also sheet 1,7
TWI1-SCK: J10.P$6(SCL) R57.2 ; also sheet 2
TWI1-SDA: J10.P$4(SDA) R56.2 ; also sheet 2
UBOOT: ESD6.2 R59.1 S2.2(S) ; also sheet 2
VCC_3V: C51.1 FB7.2 FB8.1 R58.2 R59.2 R60.2 R61.2 R62.2 R65.1 ; also sheet 1,3,4,6,7,8
Unconnected: X3.1 X3.2 X3.3 X3.4 X3.5 X3.6 X3.7 X3.8 X3.24 X3.25 X3.26 X3.27 X3.30

## Sheet 6 of 8: HDMIN & SD & SATA
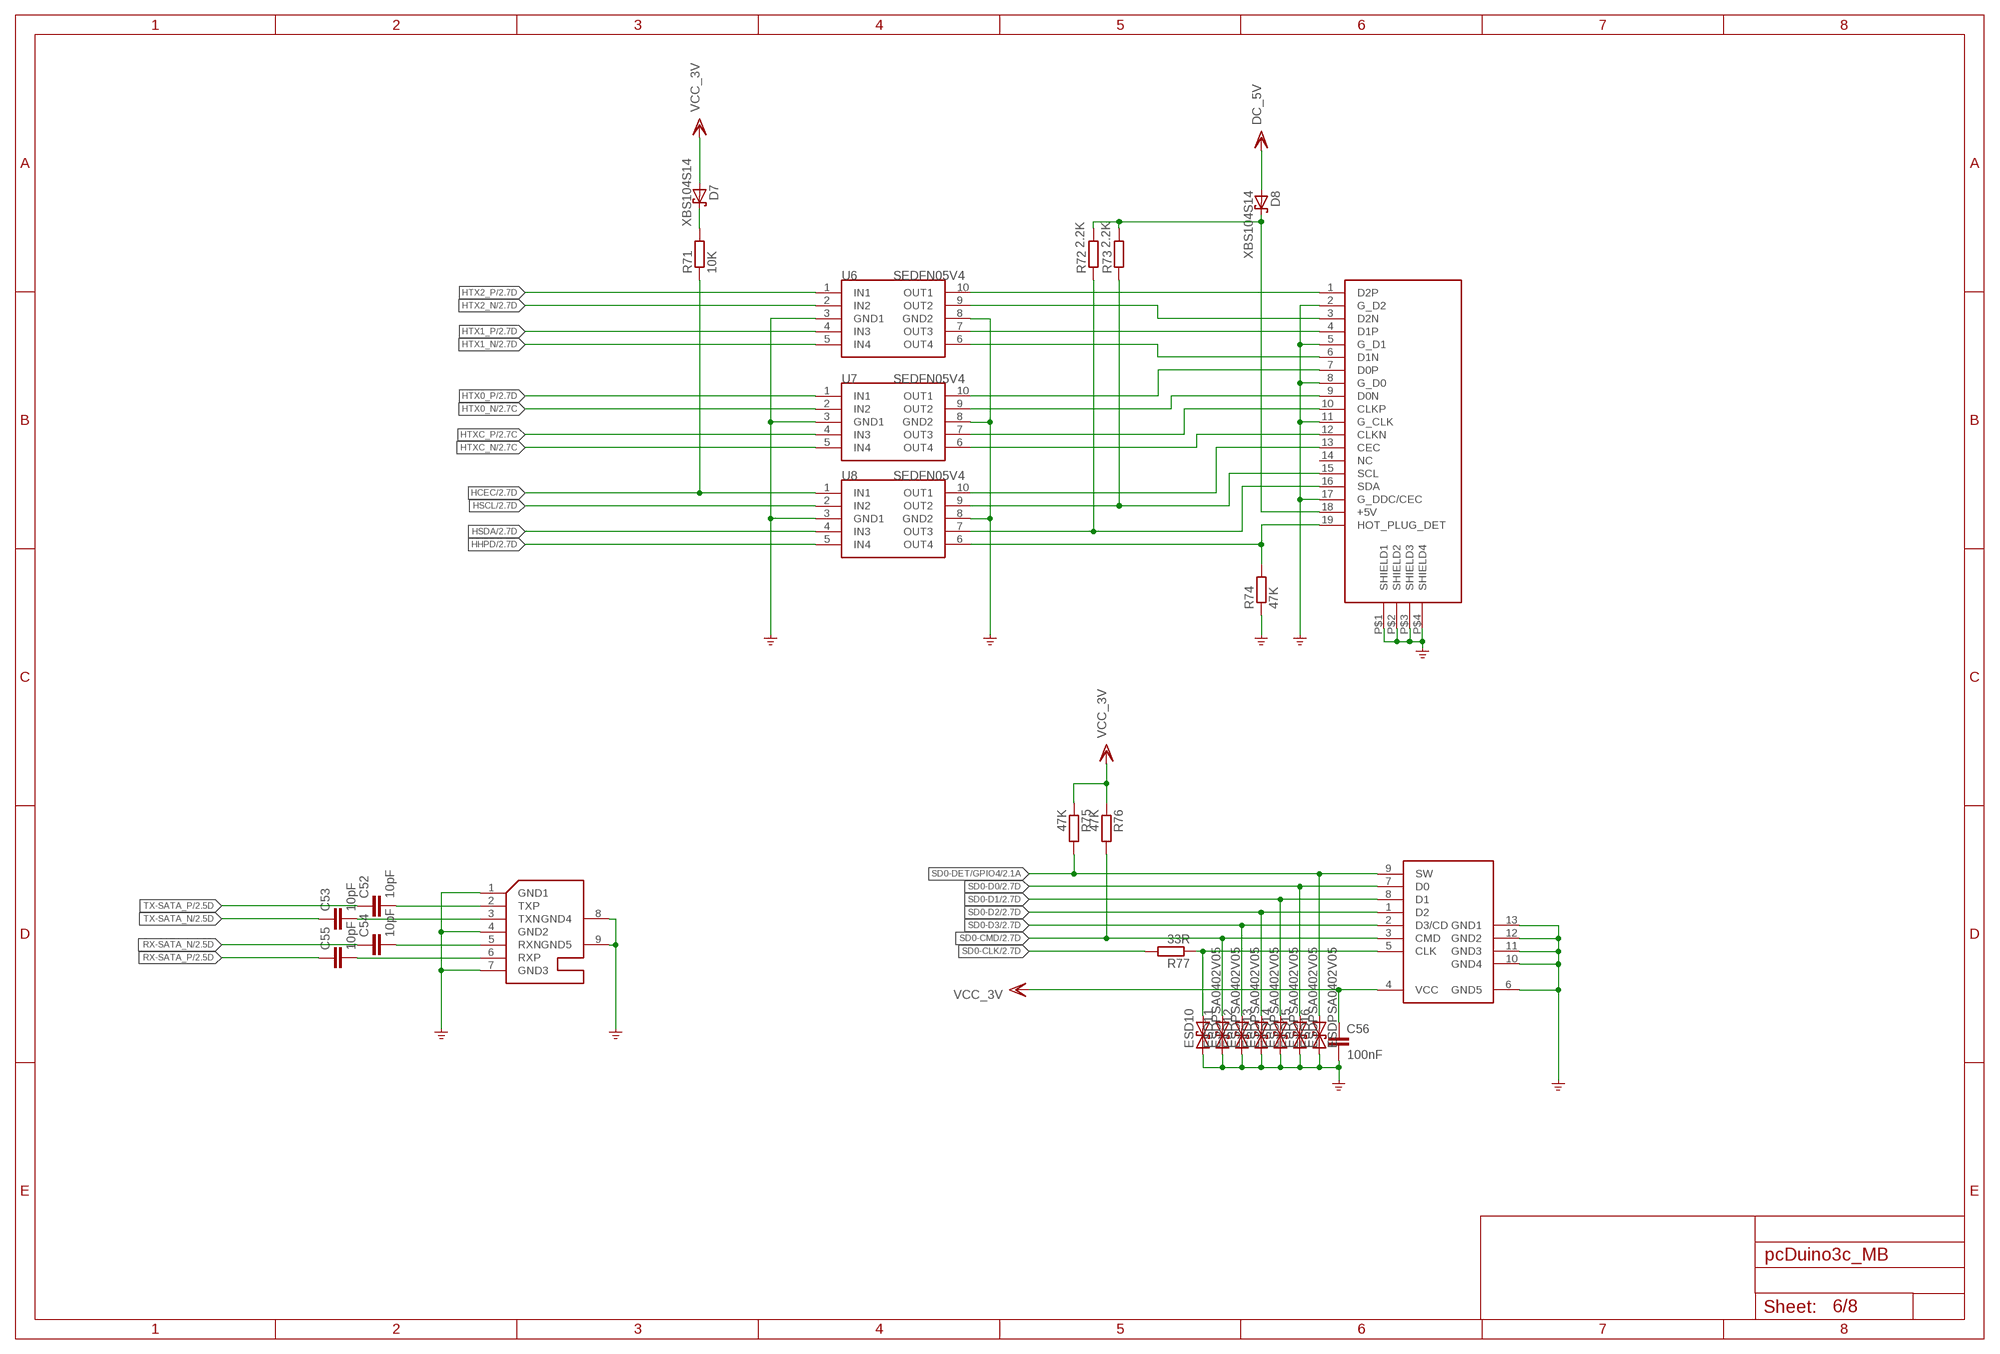
[diagram p5: schematic, sheet 6]

### Parts
C52  10pF  C-EUC0402K  [C0402K]
C53  10pF  C-EUC0402K  [C0402K]
C54  10pF  C-EUC0402K  [C0402K]
C55  10pF  C-EUC0402K  [C0402K]
C56  100nF  C-EUC0402K  [C0402K]
D7  XBS104S14  SCHOTTKY  [D1206]
D8  XBS104S14  SCHOTTKY  [D1206]
ESD10  ESDPSA0402V05  [R0402]
ESD11  ESDPSA0402V05  [R0402]
ESD12  ESDPSA0402V05  [R0402]
ESD13  ESDPSA0402V05  [R0402]
ESD14  ESDPSA0402V05  [R0402]
ESD15  ESDPSA0402V05  [R0402]
ESD16  ESDPSA0402V05  [R0402]
J11  CON-HDMI  [CON-HDMI]
J12  SOCKET-MICROSD  [SOCKET-MICROSD]
J13  CON-SATA  [CON-SATA]
R71  10K  R-EU_R0402  [R0402]
R72  2.2K  R-EU_R0402  [R0402]
R73  2.2K  R-EU_R0402  [R0402]
R74  47K  R-EU_R0402  [R0402]
R75  47K  R-EU_R0402  [R0402]
R76  47K  R-EU_R0402  [R0402]
R77  33R  R-EU_R0402  [R0402]
U6  SEDFN05V4  [RCLAMP0524P_1PRIMARY]
U7  SEDFN05V4  [RCLAMP0524P_1PRIMARY]
U8  SEDFN05V4  [RCLAMP0524P_1PRIMARY]

### Nets
DC_5V: D8.+(A) ; also sheet 1,2,5,7
GND: C56.1 ESD10.1 ESD11.1 ESD12.1 ESD13.1 ESD14.1 ESD15.1 ESD16.1 J11.2(G_D2) J11.5(G_D1) J11.8(G_D0) J11.11(G_CLK) J11.17(G_DDC/CEC) J11.P$1(SHIELD1) J11.P$2(SHIELD2) J11.P$3(SHIELD3) J11.P$4(SHIELD4) J12.6(GND5) J12.10(GND4) J12.11(GND3) J12.12(GND2) J12.13(GND1) J13.1(GND1) J13.4(GND2) J13.7(GND3) J13.8(GND4) J13.9(GND5) R74.1 U6.3(GND1) U6.8(GND2) U7.3(GND1) U7.8(GND2) U8.3(GND1) U8.8(GND2) ; also sheet 1,2,3,4,5,7,8
HCEC: J11.13(CEC) R71.1 U8.1(IN1) U8.10(OUT1) ; also sheet 2
HHPD: J11.19(HOT_PLUG_DET) R74.2 U8.5(IN4) U8.6(OUT4) ; also sheet 2
HSCL: J11.15(SCL) R73.1 U8.2(IN2) U8.9(OUT2) ; also sheet 2
HSDA: J11.16(SDA) R72.1 U8.4(IN3) U8.7(OUT3) ; also sheet 2
HTX0_N: J11.9(D0N) U7.2(IN2) U7.9(OUT2) ; also sheet 2
HTX0_P: J11.7(D0P) U7.1(IN1) U7.10(OUT1) ; also sheet 2
HTX1_N: J11.6(D1N) U6.5(IN4) U6.6(OUT4) ; also sheet 2
HTX1_P: J11.4(D1P) U6.4(IN3) U6.7(OUT3) ; also sheet 2
HTX2_N: J11.3(D2N) U6.2(IN2) U6.9(OUT2) ; also sheet 2
HTX2_P: J11.1(D2P) U6.1(IN1) U6.10(OUT1) ; also sheet 2
HTXC_N: J11.12(CLKN) U7.5(IN4) U7.6(OUT4) ; also sheet 2
HTXC_P: J11.10(CLKP) U7.4(IN3) U7.7(OUT3) ; also sheet 2
N$69: D8.-(C) J11.18(+5V) R72.2 R73.2
N$81: D7.-(C) R71.2
N$82: C52.2 J13.2(TXP)
N$102: C53.2 J13.3(TXN)
N$108: C54.2 J13.5(RXN)
N$109: C55.2 J13.6(RXP)
N$119: ESD10.2 J12.5(CLK) R77.1
RX-SATA_N: C54.1 ; also sheet 2
RX-SATA_P: C55.1 ; also sheet 2
SD0-CLK: R77.2 ; also sheet 2
SD0-CMD: ESD11.2 J12.3(CMD) R76.2 ; also sheet 2
SD0-D0: ESD15.2 J12.7(D0) ; also sheet 2
SD0-D1: ESD14.2 J12.8(D1) ; also sheet 2
SD0-D2: ESD13.2 J12.1(D2) ; also sheet 2
SD0-D3: ESD12.2 J12.2(D3/CD) ; also sheet 2
SD0-DET/GPIO4: ESD16.2 J12.9(SW) R75.2 ; also sheet 2
TX-SATA_N: C53.1 ; also sheet 2
TX-SATA_P: C52.1 ; also sheet 2
VCC_3V: C56.2 D7.+(A) J12.4(VCC) R75.1 R76.1 ; also sheet 1,3,4,5,7,8
Unconnected: J11.14(NC)

## Sheet 7 of 8: Arduino
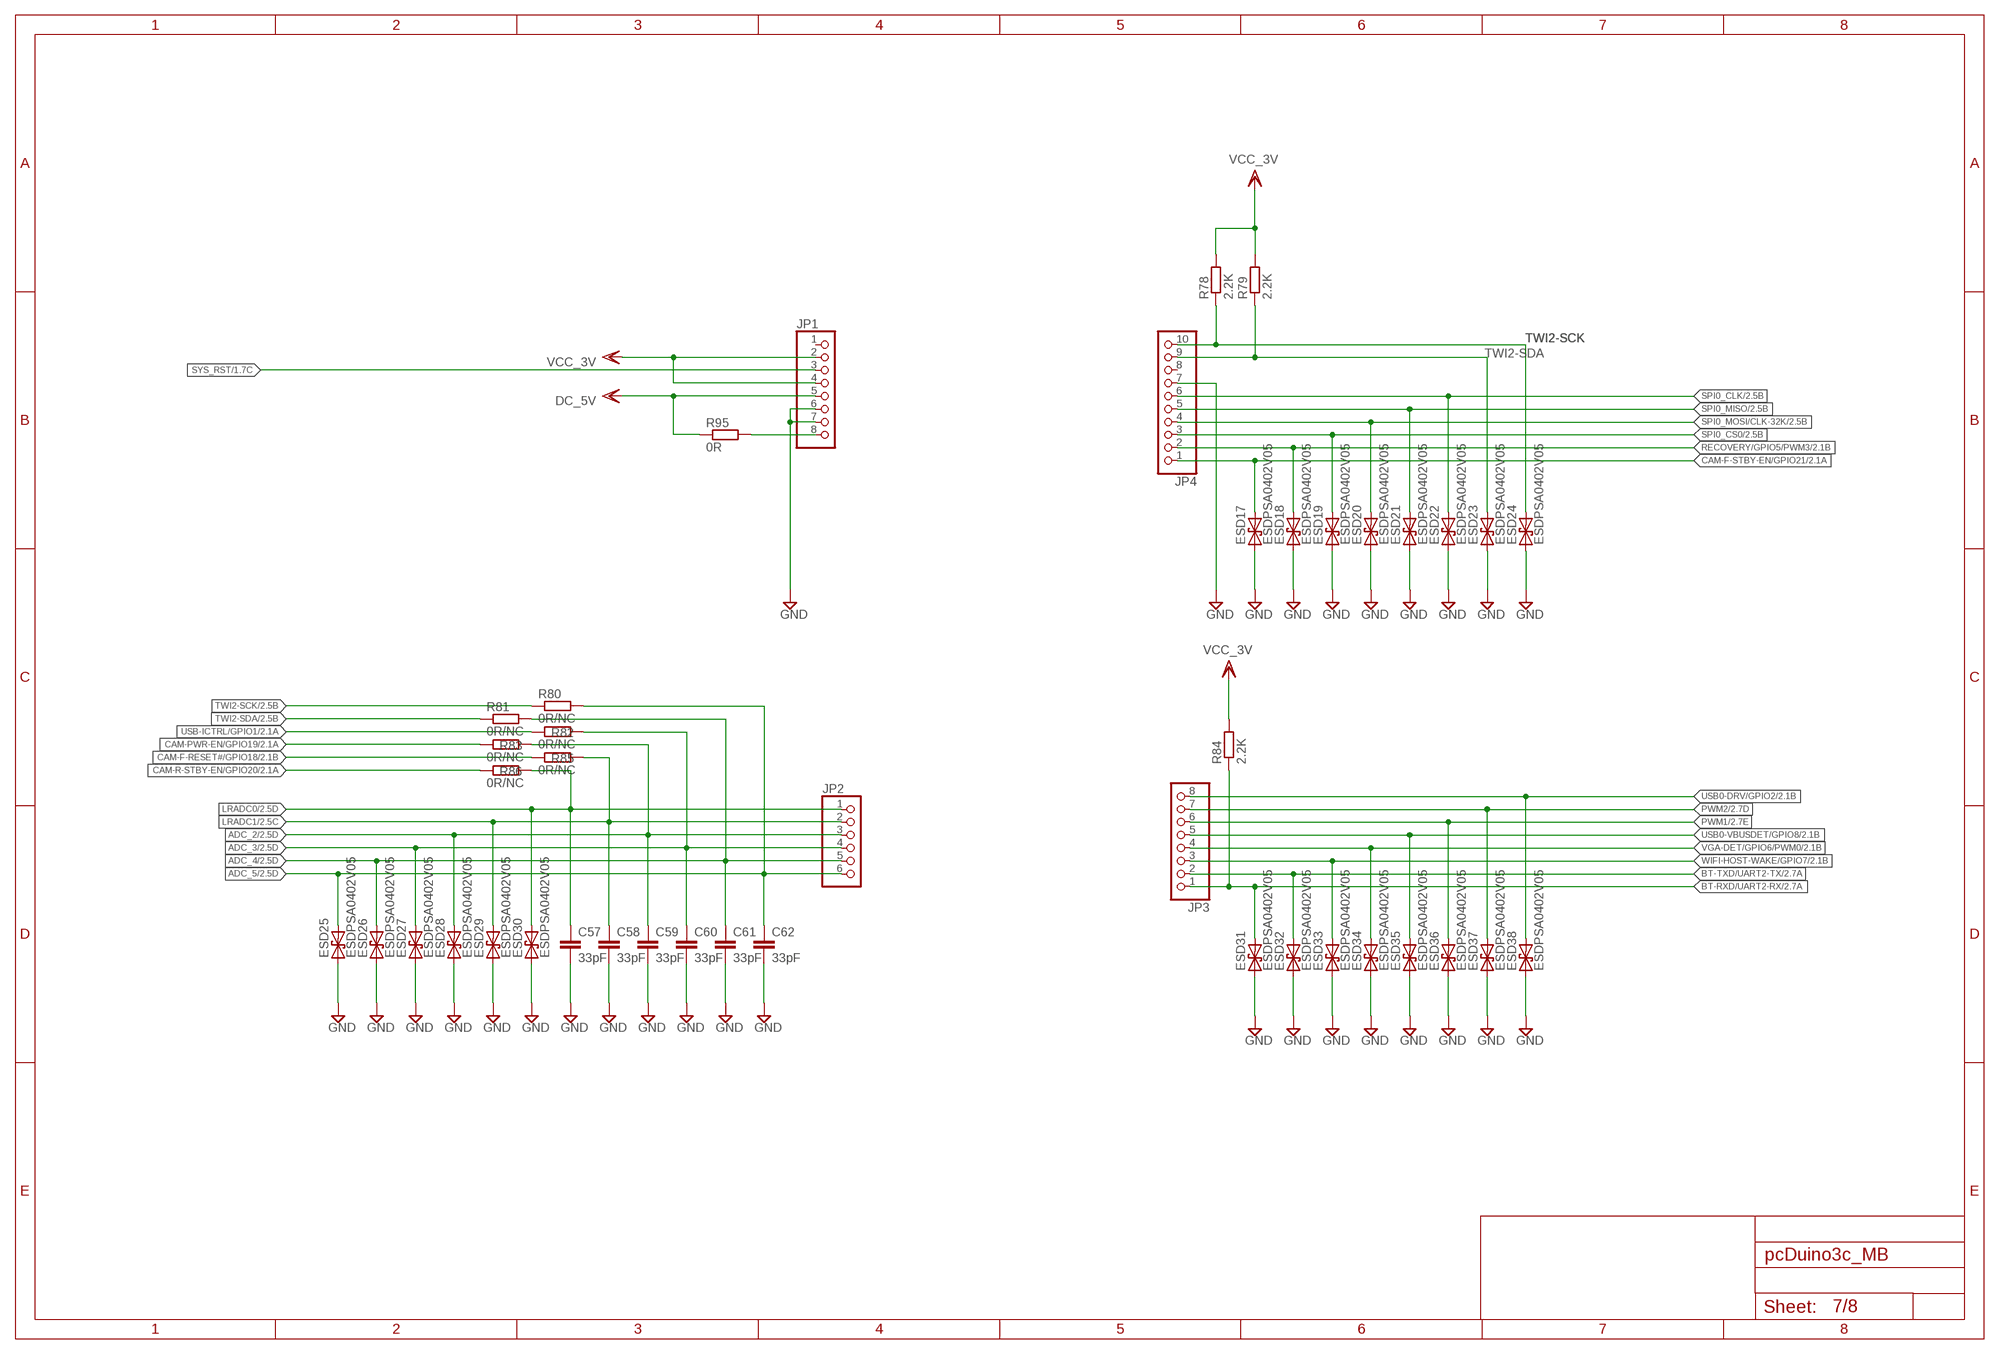
[diagram p6: schematic, sheet 7]

### Parts
C57  33pF  C-EUC0402K  [C0402K]
C58  33pF  C-EUC0402K  [C0402K]
C59  33pF  C-EUC0402K  [C0402K]
C60  33pF  C-EUC0402K  [C0402K]
C61  33pF  C-EUC0402K  [C0402K]
C62  33pF  C-EUC0402K  [C0402K]
ESD17  ESDPSA0402V05  [R0402]
ESD18  ESDPSA0402V05  [R0402]
ESD19  ESDPSA0402V05  [R0402]
ESD20  ESDPSA0402V05  [R0402]
ESD21  ESDPSA0402V05  [R0402]
ESD22  ESDPSA0402V05  [R0402]
ESD23  ESDPSA0402V05  [R0402]
ESD24  ESDPSA0402V05  [R0402]
ESD25  ESDPSA0402V05  [R0402]
ESD26  ESDPSA0402V05  [R0402]
ESD27  ESDPSA0402V05  [R0402]
ESD28  ESDPSA0402V05  [R0402]
ESD29  ESDPSA0402V05  [R0402]
ESD30  ESDPSA0402V05  [R0402]
ESD31  ESDPSA0402V05  [R0402]
ESD32  ESDPSA0402V05  [R0402]
ESD33  ESDPSA0402V05  [R0402]
ESD34  ESDPSA0402V05  [R0402]
ESD35  ESDPSA0402V05  [R0402]
ESD36  ESDPSA0402V05  [R0402]
ESD37  ESDPSA0402V05  [R0402]
ESD38  ESDPSA0402V05  [R0402]
JP1  PINHD-1X8  [1X08]
JP2  PINHD-1X6  [1X06]
JP3  PINHD-1X8  [1X08]
JP4  PINHD-1X10  [1X10]
R78  2.2K  R-EU_R0402  [R0402]
R79  2.2K  R-EU_R0402  [R0402]
R80  0R/NC  R-EU_R0402  [R0402]
R81  0R/NC  R-EU_R0402  [R0402]
R82  0R/NC  R-EU_R0402  [R0402]
R83  0R/NC  R-EU_R0402  [R0402]
R84  2.2K  R-EU_R0402  [R0402]
R85  0R/NC  R-EU_R0402  [R0402]
R86  0R/NC  R-EU_R0402  [R0402]
R95  0R  R-EU_R0805  [R0805]

### Nets
ADC_2: C59.1 ESD28.2 JP2.3 R83.2 ; also sheet 2
ADC_3: C60.1 ESD27.2 JP2.4 R82.2 ; also sheet 2
ADC_4: C61.1 ESD26.2 JP2.5 R81.2 ; also sheet 2
ADC_5: C62.1 ESD25.2 JP2.6 R80.2 ; also sheet 2
BT-RXD/UART2-RX: ESD31.2 JP3.1 R84.1 ; also sheet 2
BT-TXD/UART2-TX: ESD32.2 JP3.2 ; also sheet 2
CAM-F-RESET#/GPIO18: R85.1 ; also sheet 2
CAM-F-STBY-EN/GPIO21: ESD17.2 JP4.1 ; also sheet 2
CAM-PWR-EN/GPIO19: R83.1 ; also sheet 2
CAM-R-STBY-EN/GPIO20: R86.1 ; also sheet 2
DC_5V: JP1.5 R95.1 ; also sheet 1,2,5,6
GND: C57.2 C58.2 C59.2 C60.2 C61.2 C62.2 ESD17.1 ESD18.1 ESD19.1 ESD20.1 ESD21.1 ESD22.1 ESD23.1 ESD24.1 ESD25.1 ESD26.1 ESD27.1 ESD28.1 ESD29.1 ESD30.1 ESD31.1 ESD32.1 ESD33.1 ESD34.1 ESD35.1 ESD36.1 ESD37.1 ESD38.1 JP1.6 JP1.7 JP4.7 ; also sheet 1,2,3,4,5,6,8
LRADC0: C57.1 ESD30.2 JP2.1 R86.2 ; also sheet 2
LRADC1: C58.1 ESD29.2 JP2.2 R85.2 ; also sheet 2
N$1: JP1.8 R95.2
PWM1: ESD36.2 JP3.6 ; also sheet 2
PWM2: ESD37.2 JP3.7 ; also sheet 2
RECOVERY/GPIO5/PWM3: ESD18.2 JP4.2 ; also sheet 2
SPI0_CLK: ESD22.2 JP4.6 ; also sheet 2
SPI0_CS0: ESD19.2 JP4.3 ; also sheet 2
SPI0_MISO: ESD21.2 JP4.5 ; also sheet 2
SPI0_MOSI/CLK-32K: ESD20.2 JP4.4 ; also sheet 2
SYS_RST: JP1.3 ; also sheet 1,5
TWI2-SCK: ESD24.2 JP4.10 R78.1 R80.1 ; also sheet 2
TWI2-SDA: ESD23.2 JP4.9 R79.1 R81.1 ; also sheet 2
USB0-DRV/GPIO2: ESD38.2 JP3.8 ; also sheet 2
USB0-VBUSDET/GPIO8: ESD35.2 JP3.5 ; also sheet 2
USB-ICTRL/GPIO1: R82.1 ; also sheet 2
VCC_3V: JP1.2 JP1.4 R78.2 R79.2 R84.2 ; also sheet 1,3,4,5,6,8
VGA-DET/GPIO6/PWM0: ESD34.2 JP3.4 ; also sheet 2
WIFI-HOST-WAKE/GPIO7: ESD33.2 JP3.3 ; also sheet 2
Unconnected: JP1.1 JP4.8

## Sheet 8 of 8: Audio & DBG
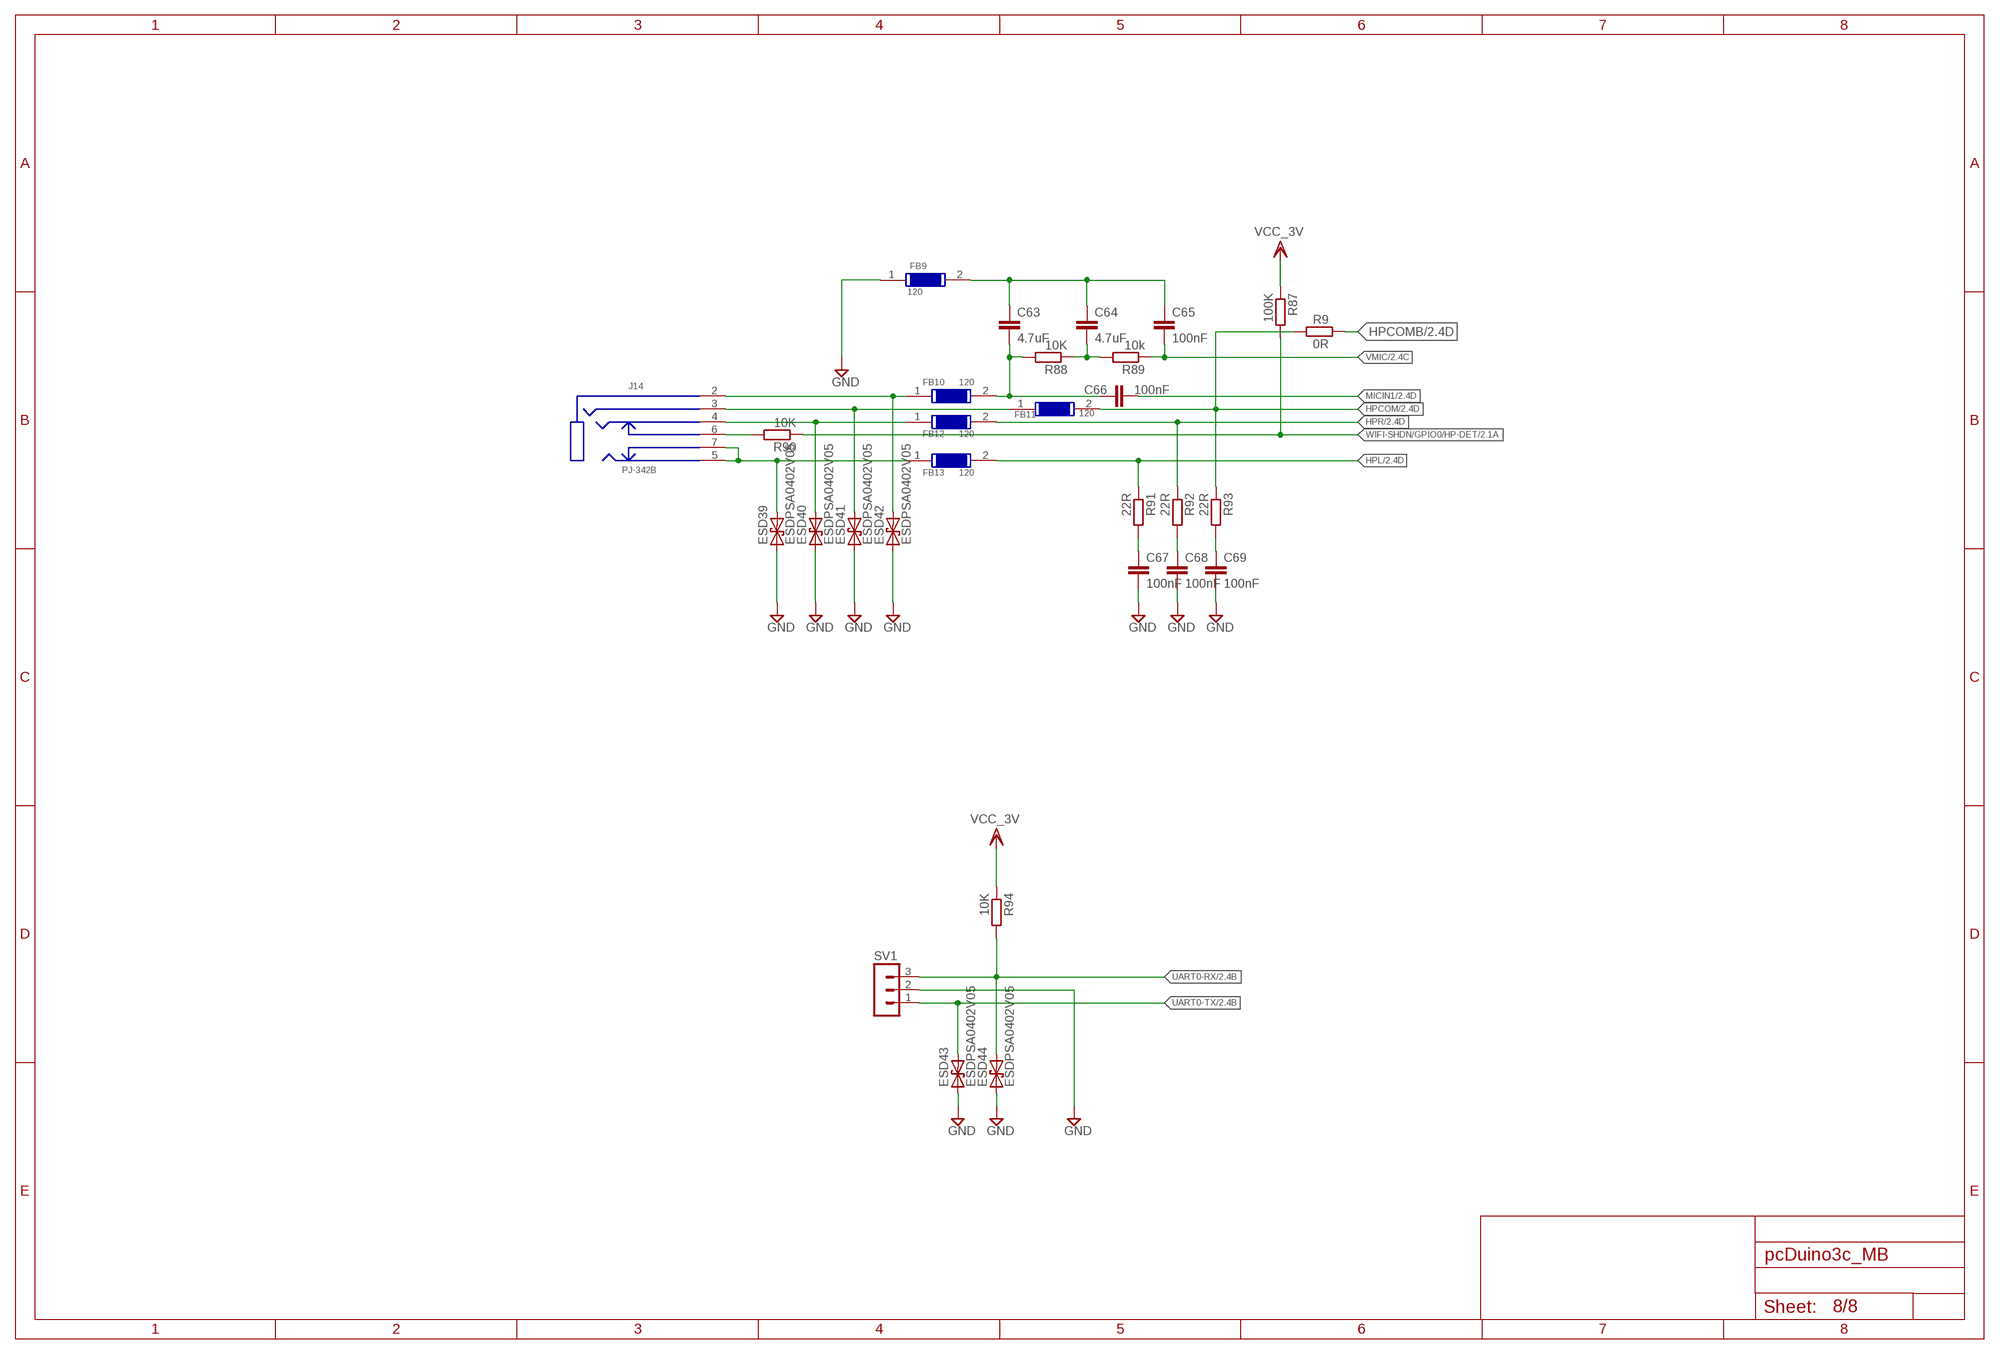
[diagram p7: schematic, sheet 8]

### Parts
C63  4.7uF  C-EUC0402K  [C0402K]
C64  4.7uF  C-EUC0402K  [C0402K]
C65  100nF  C-EUC0402K  [C0402K]
C66  100nF  C-EUC0402K  [C0402K]
C67  100nF  C-EUC0402K  [C0402K]
C68  100nF  C-EUC0402K  [C0402K]
C69  100nF  C-EUC0402K  [C0402K]
ESD39  ESDPSA0402V05  [R0402]
ESD40  ESDPSA0402V05  [R0402]
ESD41  ESDPSA0402V05  [R0402]
ESD42  ESDPSA0402V05  [R0402]
ESD43  ESDPSA0402V05  [R0402]
ESD44  ESDPSA0402V05  [R0402]
FB9  120  LI0603EXXXR-10  [R0603]
FB10  120  LI0603EXXXR-10  [R0603]
FB11  120  LI0603EXXXR-10  [R0603]
FB12  120  LI0603EXXXR-10  [R0603]
FB13  120  LI0603EXXXR-10  [R0603]
J14  PJ-342B  [PJ-342B]
R9  0R  R-EU_R0402  [R0402]
R87  100K  R-EU_R0402  [R0402]
R88  10K  R-EU_R0402  [R0402]
R89  10k  R-EU_R0402  [R0402]
R90  10K  R-EU_R0402  [R0402]
R91  22R  R-EU_R0402  [R0402]
R92  22R  R-EU_R0402  [R0402]
R93  22R  R-EU_R0402  [R0402]
R94  10K  R-EU_R0402  [R0402]
SV1  MA03-1  [MA03-1]

### Nets
GND: C67.2 C68.2 C69.2 ESD39.1 ESD40.1 ESD41.1 ESD42.1 ESD43.1 ESD44.1 FB9.1 SV1.2 ; also sheet 1,2,3,4,5,6,7
HPCOM: FB11.2 R9.1 R93.1 ; also sheet 2
HPCOMB: R9.2 ; also sheet 2
HPL: FB13.2 R91.1 ; also sheet 2
HPR: FB12.2 R92.1 ; also sheet 2
MICIN1: C66.2 ; also sheet 2
N$4: ESD41.2 FB11.1 J14.3
N$5: ESD40.2 FB12.1 J14.4
N$6: ESD42.2 FB10.1 J14.2
N$7: ESD39.2 FB13.1 J14.5 J14.7
N$8: C67.1 R91.2
N$9: C68.1 R92.2
N$10: C69.1 R93.2
N$12: C63.2 C66.1 FB10.2 R88.2
N$14: C64.2 R88.1 R89.2
N$16: C63.1 C64.1 C65.1 FB9.2
N$58: J14.6 R90.2
UART0-RX: ESD44.2 R94.2 SV1.3 ; also sheet 2
UART0-TX: ESD43.2 SV1.1 ; also sheet 2
VCC_3V: R87.1 R94.1 ; also sheet 1,3,4,5,6,7
VMIC: C65.2 R89.1 ; also sheet 2
WIFI-SHDN/GPIO0/HP-DET: R87.2 R90.1 ; also sheet 2

## Library data of the parts
C1-C19 C21-C69 = MyLibrary:C-EU: CAPACITOR, European symbol; SPICEPREFIX: C
C20 = MyLibrary:CPOL-EU: POLARIZED CAPACITOR, European symbol
D2 D6 = MyLibrary:LED
D5 = MyLibrary:DIODE-SMD
D7 D8 = MyLibrary:SCHOTTKY
ESD1-ESD44 = MyLibrary:ESDPSA0402V05
F1 = MyLibrary:PTCFUSE: PTC fuses, resettable thermistors
FB1-FB13 = MyLibrary:LI0603EXXXR-10
J1 = MyLibrary:CON-BAT
J2 = con-jack:DCJ0202: DC POWER JACK Source: DCJ0202.pdf; OC_FARNELL: unknown; OC_NEWARK: unknown
J3 = MyLibrary:BTB-50PIN-0.8-1
J4 = MyLibrary:BTB-50PIN-0.8-3
J5 = MyLibrary:BTB-50PIN-0.8-2
J7 = MyLibrary:CON-USB
J8 = MyLibrary:PCDUINO_WIFI_P1
J10 = MyLibrary:Q1S02B
J11 = MyLibrary:CON-HDMI
J12 = MyLibrary:SOCKET-MICROSD
J13 = MyLibrary:CON-SATA
J14 = MyLibrary:PJ-342B: http://item.taobao.com/item.htm?spm=a230r.1.14.1.TttnkO&id=36093278712&ns=1&_u=g3siqrcbd80#detail
J15 = MyLibrary:BTB-50PIN-0.8-4
JP1 JP3 = pinhead:PINHD-1X8: PIN HEADER
JP2 = pinhead:PINHD-1X6: PIN HEADER
JP4 = pinhead:PINHD-1X10: PIN HEADER
L1 = MyLibrary:INDICATOR
L2-L4 = MyLibrary:IND-CL-2M2012
PWR = MyLibrary:PWR2P
Q1 Q2 = MyLibrary:P-MOS: Si2305DS Si2323CDS
R1-R13 R15 R17 R19-R95 = MyLibrary:R-EU_: RESISTOR, European symbol; SPICEPREFIX: R
S1-S5 = MyLibrary:SMD_KEY
SV1 = con-lstb:MA03-1: PIN HEADER; OC_FARNELL: unknown; OC_NEWARK: unknown
T1-T4 = transistor:*-NPN-: NPN Transistror BF959 corrected 2008.03.06
U1 = MyLibrary:SY8088
U2 U3 = MyLibrary:RT9701GB
U4 = MyLibrary:IP101ALF
U6-U8 = MyLibrary:SEDFN05V4
U9 = MyLibrary:INFARED
X1 = con-pulse:J1011F: PULSEJACK (TM) 1x1 Tab-UP RJ45 10/100 Base-TX RJ45 1x1 Tab-UP with LEDs 8-pin (J1 series) and 6-pin (JP series) integrated magnetics connector, designed to support applications, such as ADSL modems, LAN-on-Motherboard, and Hub and Switches. Source: www.pulseeng.com .. PulseJack-J402.pdf; OC_FARNELL: unknown; OC_NEWARK: unknown
X2 = con-cypressindustries:MINI-USB-: MINI USB-B Conector Source: www.cypressindustries.com; OC_FARNELL: unknown; OC_NEWARK: unknown
X3 = MyLibrary:FH12-30S-0.5S: 0.5mm Pitch Connectors For FPC/FFC Source: Data sheet <http://www.hirose.co.jp/cataloge_hp/e58605370.pdf>; MPN: FH12-30S-0.5SH(55); OC_FARNELL: 1324555; OC_NEWARK: 34M6176
Y1 = MyLibrary:XTAL-4: Classic 4-pin 3.2 x 2.5mm crystal

## Net classes
0 default: clearance 0.205 mm
1 GND: width 0.406 mm, drill 0.61 mm, clearance 0.203 mm to class 0
2 DC_5V: width 0.406 mm, drill 0.61 mm, clearance 0.203 mm to class 0, clearance 0.203 mm to class 1